# EAGLE board dsp_ice_rev1 (EAGLE 7.6.0), part 1 of 2
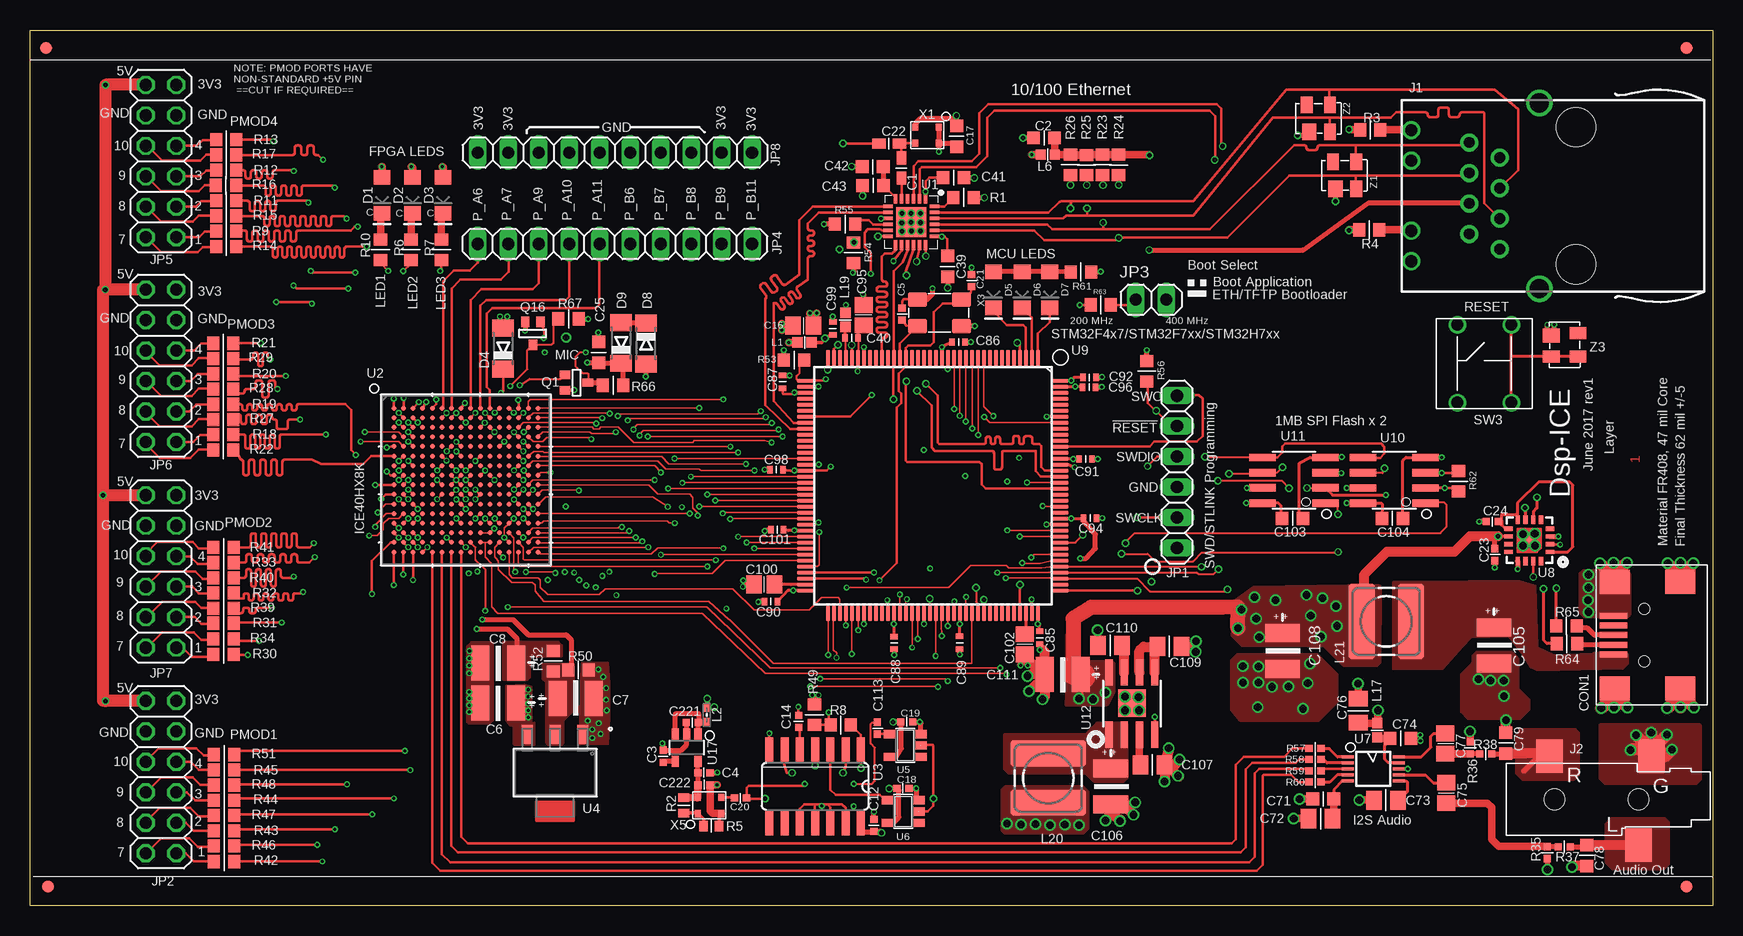
[diagram p9: board, top side]
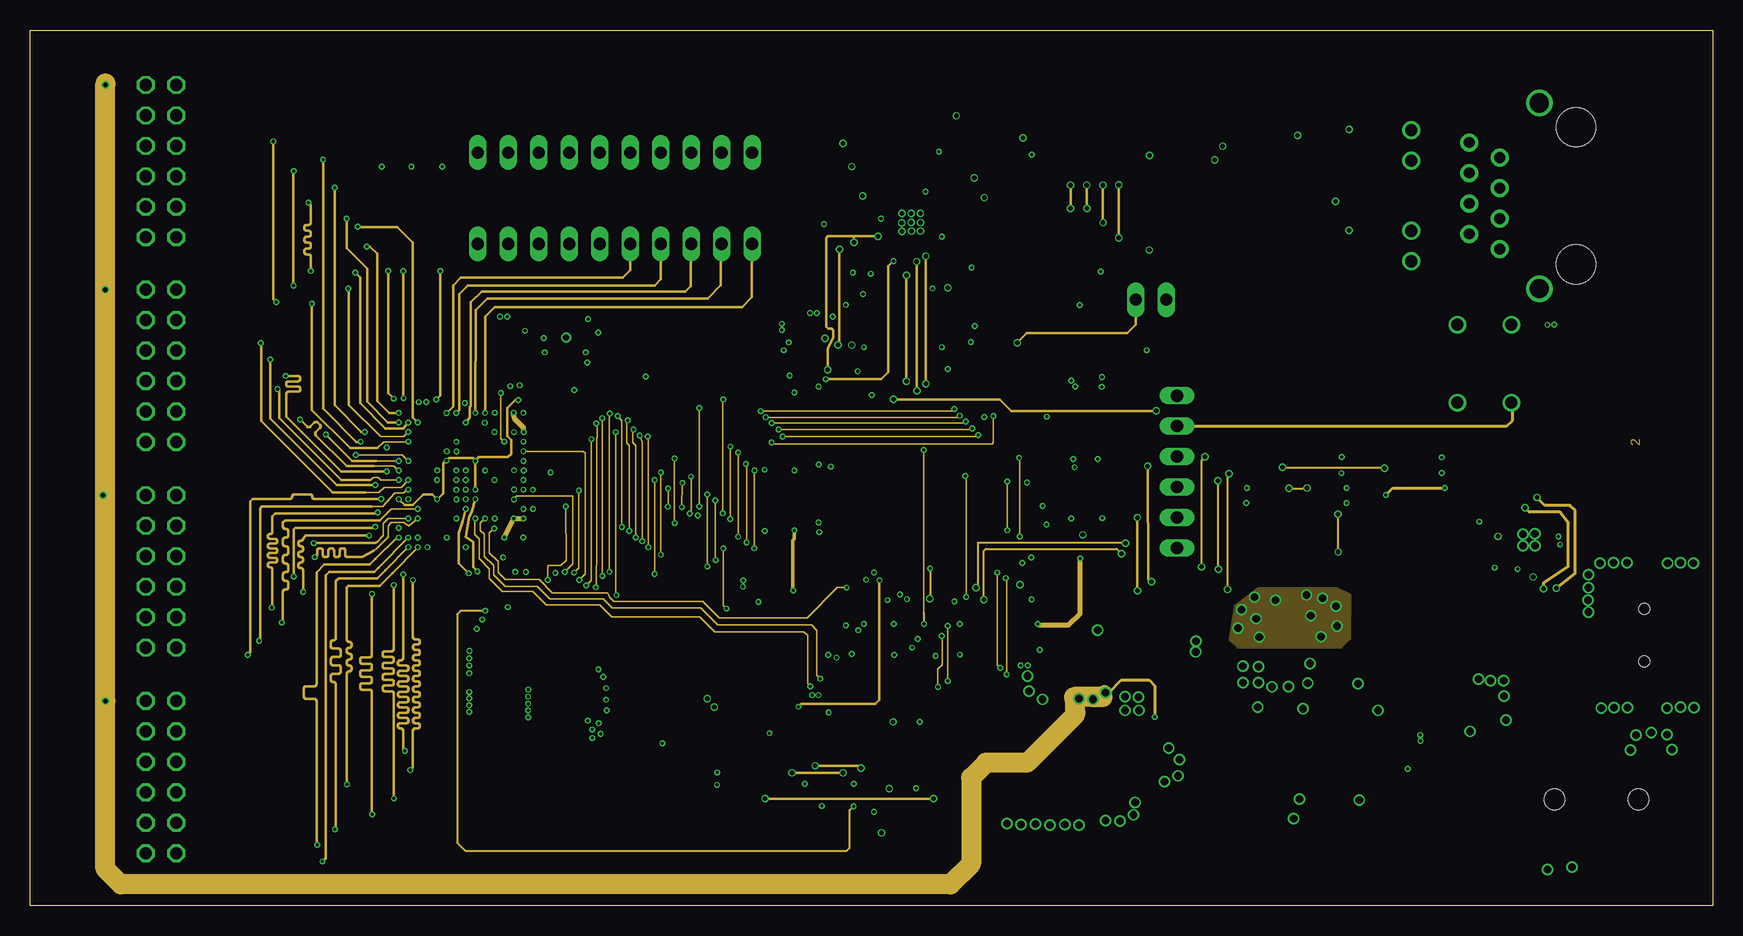
[diagram p10: board, inner layer Route2]
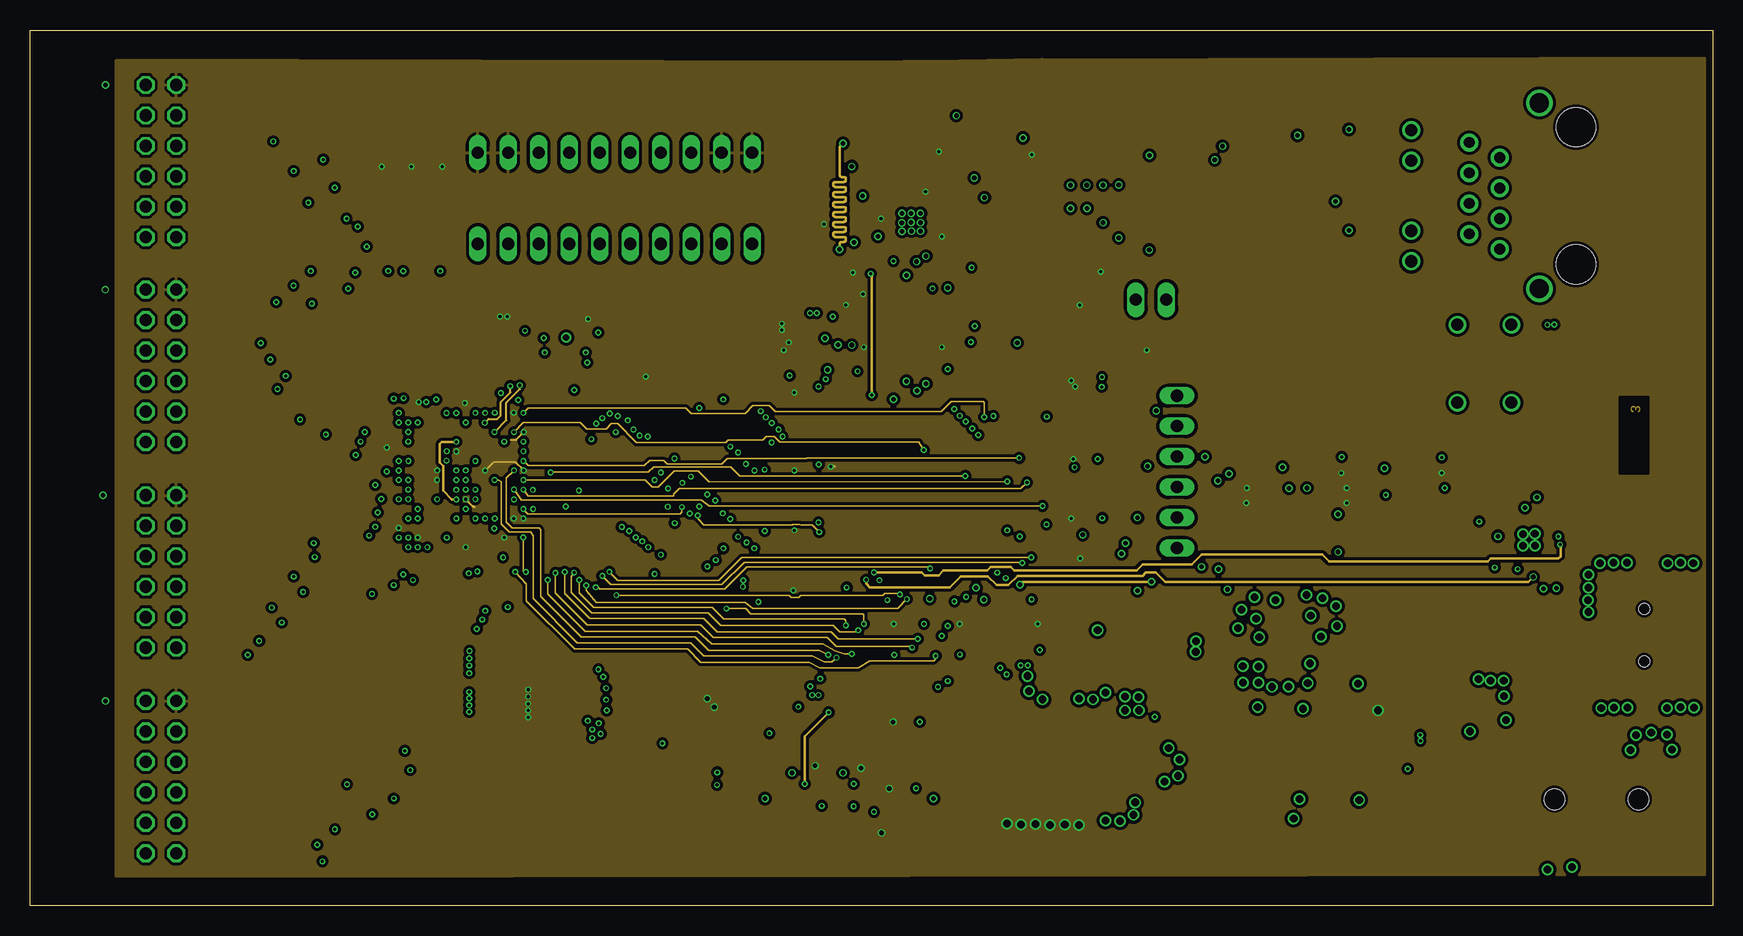
[diagram p11: board, inner layer Route3]
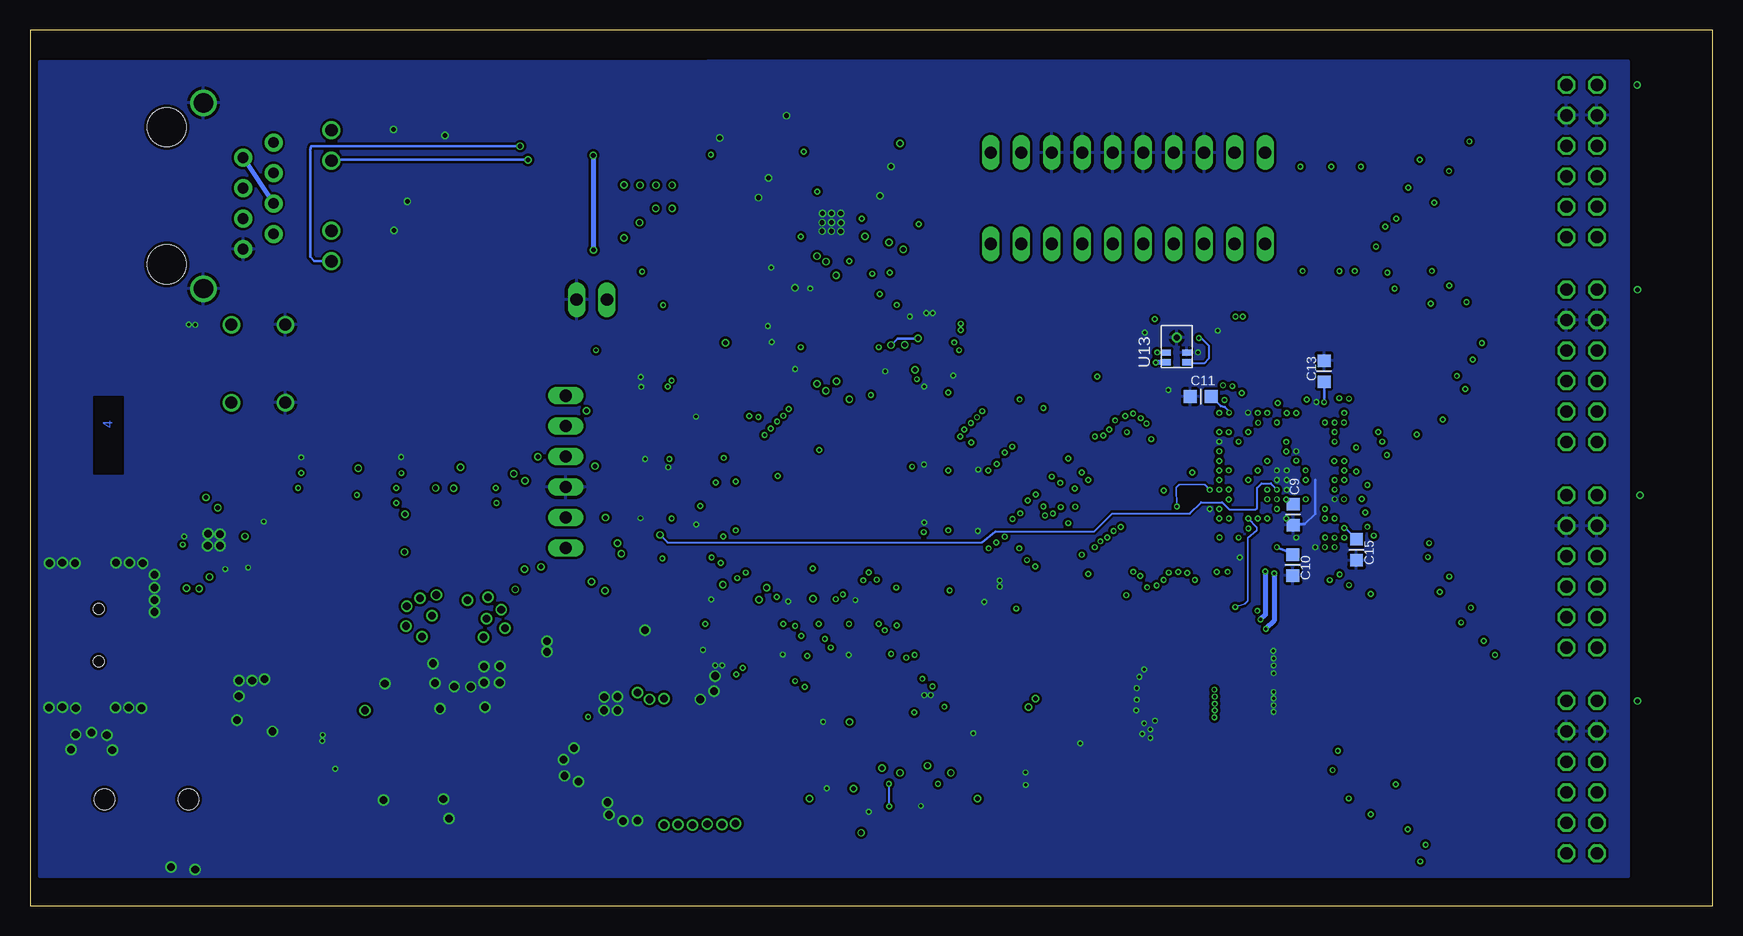
[diagram p12: board, bottom side, seen from below]

Size 140.23 x 73 mm. Coordinates in mm from the lower left corner, seen from the top.
Outline: 0,73 140.23,73 140.23,0 0,0 0,73
Copper layers (1+2+3+16): Top 0.035mm / dielectric 0.2mm / Route2 0.035mm / dielectric 0.15mm / Route3 0.035mm / dielectric 0.2mm / Bottom 0.035mm
Design rules "default *": minimum track width 5mil, minimum drill 10mil, track to track 5mil, track to pad 5mil, pad to pad 5mil, via to via 5mil, smd to smd 1mil, copper to edge 10mil, drill to drill 10mil, minimum pad ring 4.5mil, minimum via ring 4.5mil, stop-mask expansion 0mil, vias tented up to drill 25mil, thermal gap 10mil

## Footprints (pad centres in the part's own frame; a part is rotated, then mirrored left to right if it is on the bottom)
C0603 = smd 1.1 x 0.813: 1 -0.85,0; 2 0.85,0
C0603' = smd 1.05 x 1.08: 1 -0.875,0; 2 0.875,0
C0402 = smd 0.6 x 0.6: 1 -0.5,0; 2 0.501,0
1210K = smd 1.5 x 2.9: A -1.5,0; C 1.5,0
C0805 = smd 1.3 x 1.5: 1 -0.85,0; 2 0.85,0
0402 = smd 0.457 x 0.61: 1 -0.524,0; 2 0.549,0
C0805' = smd 1.3 x 1.6: 1 -1,0; 2 1,0
1734035-2 = smd 2.3 x 0.5: 1 2.9,1.45; 2 2.9,0.65; 3 2.9,-0.15; 4 2.9,-0.95; 5 2.9,-1.75 | smd 2.5 x 2: 6 -2.65,-4.6; 7 -2.65,4.3; 8 2.8,-4.6; 9 2.8,4.3 | hole 0.9: 0.35,2.05; 0.35,-2.35
LED-1206 = smd 1.2 x 1.4: A -1.5,0; C 1.5,0
MINIMELF = smd 1.4 x 1.8: A 1.7,0; C -1.7,0
FIDUCIAL = smd 1.016 x 1.016: 1 0,0
SI-50170 = drill 0.9 pad 1.5: 1 4.445,5.842; 2 3.175,3.302; 3 1.905,5.842; 4 0.635,3.302; 5 -0.635,5.842; 6 -1.905,3.302; 7 -3.175,5.842; 8 -4.445,3.302 | drill 1.016 pad 1.5: A1 -5.461,10.668; A2 2.921,10.668; C1 -2.921,10.668; C2 5.461,10.668 | drill 1.6 pad 2.2: S1 -7.747,0; S2 7.747,0 | hole 3.251: -5.715,-3.048; 5.715,-3.048
SJ-3523 = smd 2.2 x 2.8: G 8.1,3.6; L 7,-3.8; R -0.4,3.6 | hole 1.7: 0,0; 7,0
1X06 = drill 1.016 long: 1 -6.35,0; 2 -3.81,0; 3 -1.27,0; 4 1.27,0; 5 3.81,0; 6 6.35,0
2X06 = drill 1.016 octagon: 1 -6.35,-1.27; 2 -3.81,-1.27; 3 -1.27,-1.27; 4 1.27,-1.27; 5 3.81,-1.27; 6 6.35,-1.27; 7 -6.35,1.27; 8 -3.81,1.27; 9 -1.27,1.27; 10 1.27,1.27; 11 3.81,1.27; 12 6.35,1.27
1X02 = drill 1.016 long: 1 -1.27,0; 2 1.27,0
1X10 = drill 1.016 long: 1 -11.43,0; 2 -8.89,0; 3 -6.35,0; 4 -3.81,0; 5 -1.27,0; 6 1.27,0; 7 3.81,0; 8 6.35,0; 9 8.89,0; 10 11.43,0
0603 = smd 0.864 x 0.864: 1 -0.595,0; 2 0.573,0
0402' = smd 0.7 x 0.6: 1 -0.6,0; 2 0.6,0
POWER-CHOKE_WE-TPC = smd 6.3 x 2.2: 1 0,2.05; 2 0,-2.05
SOT23_2N7002_PACKAGE = smd 0.7 x 0.9: 1 -0.642,-0.916; 2 0.641,-0.916; 3 0,0.992
R0603 = smd 1 x 1.1: 1 -0.85,0; 2 0.85,0
R0402 = smd 0.7 x 0.9: 1 -0.65,0; 2 0.65,0
R0402' = smd 0.6 x 0.6: 1 -0.5,0; 2 0.5,0
TACTILE_6X6MM = drill 1: 1 0,0; 2 4.5,0; 3 4.5,6.5; 4 0,6.5
QFN-24 = smd 0.28 x 0.8: 1 -1.205,-1.836; 2 -0.705,-1.836; 3 -0.205,-1.836; 4 0.295,-1.836; 5 0.795,-1.836; 6 1.295,-1.836; 13 1.3,2.03; 14 0.8,2.03; 15 0.3,2.03; 16 -0.2,2.03; 17 -0.7,2.03; 18 -1.2,2.03 | smd 0.8 x 0.28: 7 1.94,-1.191; 8 1.94,-0.691; 9 1.94,-0.191; 10 1.94,0.309; 11 1.94,0.809; 12 1.94,1.309; 19 -1.929,1.3; 20 -1.929,0.8; 21 -1.929,0.3; 22 -1.929,-0.2; 23 -1.929,-0.7; 24 -1.929,-1.2 | smd 2.5 x 2.5: GP 0,0.1
CABGA256 = smd 0.406 x 0.406: A1 -6,6; A2 -5.2,6; A3 -4.4,6; A4 -3.6,6; A5 -2.8,6; A6 -2,6; A7 -1.2,6; A8 -0.4,6; A9 0.4,6; A10 1.2,6; A11 2,6; A12 2.8,6; A13 3.6,6; A14 4.4,6; A15 5.2,6; A16 6,6; B1 -6,5.2; B2 -5.2,5.2; B3 -4.4,5.2; B4 -3.6,5.2; B5 -2.8,5.2; B6 -2,5.2; B7 -1.2,5.2; B8 -0.4,5.2; B9 0.4,5.2; B10 1.2,5.2; B11 2,5.2; B12 2.8,5.2; B13 3.6,5.2; B14 4.4,5.2; B15 5.2,5.2; B16 6,5.2; C1 -6,4.4; C2 -5.2,4.4; C3 -4.4,4.4; C4 -3.6,4.4; C5 -2.8,4.4; C6 -2,4.4; C7 -1.2,4.4; C8 -0.4,4.4; C9 0.4,4.4; C10 1.2,4.4; C11 2,4.4; C12 2.8,4.4; C13 3.6,4.4; C14 4.4,4.4; C15 5.2,4.4; C16 6,4.4; D1 -6,3.6; D2 -5.2,3.6; D3 -4.4,3.6; D4 -3.6,3.6; D5 -2.8,3.6; D6 -2,3.6; D7 -1.2,3.6; D8 -0.4,3.6; D9 0.4,3.6; D10 1.2,3.6; D11 2,3.6; D12 2.8,3.6; D13 3.6,3.6; D14 4.4,3.6; D15 5.2,3.6; D16 6,3.6; E1 -6,2.8; E2 -5.2,2.8; E3 -4.4,2.8; E4 -3.6,2.8; E5 -2.8,2.8; E6 -2,2.8; E7 -1.2,2.8; E8 -0.4,2.8; E9 0.4,2.8; E10 1.2,2.8; E11 2,2.8; E12 2.8,2.8; E13 3.6,2.8; E14 4.4,2.8; E15 5.2,2.8; E16 6,2.8; F1 -6,2; F2 -5.2,2; F3 -4.4,2; F4 -3.6,2; F5 -2.8,2; F6 -2,2; F7 -1.2,2; F8 -0.4,2; F9 0.4,2; F10 1.2,2; F11 2,2; F12 2.8,2; F13 3.6,2; F14 4.4,2; F15 5.2,2; F16 6,2; G1 -6,1.2; G2 -5.2,1.2; G3 -4.4,1.2; G4 -3.6,1.2; G5 -2.8,1.2; G6 -2,1.2; G7 -1.2,1.2; G8 -0.4,1.2; G9 0.4,1.2; G10 1.2,1.2; G11 2,1.2; G12 2.8,1.2; G13 3.6,1.2; G14 4.4,1.2; G15 5.2,1.2; G16 6,1.2; H1 -6,0.4; H2 -5.2,0.4; H3 -4.4,0.4; H4 -3.6,0.4; H5 -2.8,0.4; H6 -2,0.4; H7 -1.2,0.4; H8 -0.4,0.4; H9 0.4,0.4; H10 1.2,0.4; H11 2,0.4; H12 2.8,0.4; H13 3.6,0.4; H14 4.4,0.4; H15 5.2,0.4; H16 6,0.4; J1 -6,-0.4; J2 -5.2,-0.4; J3 -4.4,-0.4; J4 -3.6,-0.4; J5 -2.8,-0.4; J6 -2,-0.4; J7 -1.2,-0.4; J8 -0.4,-0.4; J9 0.4,-0.4; J10 1.2,-0.4; J11 2,-0.4; J12 2.8,-0.4; J13 3.6,-0.4; J14 4.4,-0.4; J15 5.2,-0.4; J16 6,-0.4; K1 -6,-1.2; K2 -5.2,-1.2; K3 -4.4,-1.2; K4 -3.6,-1.2; K5 -2.8,-1.2; K6 -2,-1.2; K7 -1.2,-1.2; K8 -0.4,-1.2; K9 0.4,-1.2; K10 1.2,-1.2; K11 2,-1.2; K12 2.8,-1.2; K13 3.6,-1.2; K14 4.4,-1.2; K15 5.2,-1.2; K16 6,-1.2; L1 -6,-2; L2 -5.2,-2; L3 -4.4,-2; L4 -3.6,-2; L5 -2.8,-2; L6 -2,-2; L7 -1.2,-2; L8 -0.4,-2; L9 0.4,-2; L10 1.2,-2; L11 2,-2; L12 2.8,-2; L13 3.6,-2; L14 4.4,-2; L15 5.2,-2; L16 6,-2; M1 -6,-2.8; M2 -5.2,-2.8; M3 -4.4,-2.8; M4 -3.6,-2.8; M5 -2.8,-2.8; M6 -2,-2.8; M7 -1.2,-2.8; M8 -0.4,-2.8; M9 0.4,-2.8; M10 1.2,-2.8; M11 2,-2.8; M12 2.8,-2.8; M13 3.6,-2.8; M14 4.4,-2.8; M15 5.2,-2.8; M16 6,-2.8; N1 -6,-3.6; N2 -5.2,-3.6; N3 -4.4,-3.6; N4 -3.6,-3.6; N5 -2.8,-3.6; N6 -2,-3.6; N7 -1.2,-3.6; N8 -0.4,-3.6; N9 0.4,-3.6; N10 1.2,-3.6; N11 2,-3.6; N12 2.8,-3.6; N13 3.6,-3.6; N14 4.4,-3.6; N15 5.2,-3.6; N16 6,-3.6; P1 -6,-4.4; P2 -5.2,-4.4; P3 -4.4,-4.4; P4 -3.6,-4.4; P5 -2.8,-4.4; P6 -2,-4.4; P7 -1.2,-4.4; P8 -0.4,-4.4; P9 0.4,-4.4; P10 1.2,-4.4; P11 2,-4.4; P12 2.8,-4.4; P13 3.6,-4.4; P14 4.4,-4.4; P15 5.2,-4.4; P16 6,-4.4; R1 -6,-5.2; R2 -5.2,-5.2; R3 -4.4,-5.2; R4 -3.6,-5.2; R5 -2.8,-5.2; R6 -2,-5.2; R7 -1.2,-5.2; R8 -0.4,-5.2; R9 0.4,-5.2; R10 1.2,-5.2; R11 2,-5.2; R12 2.8,-5.2; R13 3.6,-5.2; R14 4.4,-5.2; R15 5.2,-5.2; R16 6,-5.2; T1 -6,-6; T2 -5.2,-6; T3 -4.4,-6; T4 -3.6,-6; T5 -2.8,-6; T6 -2,-6; T7 -1.2,-6; T8 -0.4,-6; T9 0.4,-6; T10 1.2,-6; T11 2,-6; T12 2.8,-6; T13 3.6,-6; T14 4.4,-6; T15 5.2,-6; T16 6,-6
SO14 = smd 0.66 x 2.032: 1 -3.81,-3.073; 2 -2.54,-3.073; 3 -1.27,-3.073; 4 0,-3.073; 5 1.27,-3.073; 6 2.54,-3.073; 7 3.81,-3.073; 8 3.81,3.073; 9 2.54,3.073; 10 1.27,3.073; 11 0,3.073; 12 -1.27,3.073; 13 -2.54,3.073; 14 -3.81,3.073
SOT-223 = smd 0.914 x 1.6: 1 -2.3,-3.2; 2 0,-3.2; 3 2.3,-3.2
SOT23-5 = smd 0.69 x 0.99: 1 -0.95,-1.29; 2 0,-1.29; 3 0.95,-1.29; 4 0.95,1.3; 5 -0.95,1.3
MSOP10 = smd 0.25 x 1: 1 -1,-2.113; 2 -0.5,-2.113; 3 0,-2.113; 4 0.5,-2.113; 5 1,-2.113; 6 1,2.113; 7 0.5,2.113; 8 0,2.113; 9 -0.5,2.113; 10 -1,2.113
QFN16 = smd 0.7 x 0.35: 1 -1.725,0.975; 2 -1.725,0.325; 3 -1.725,-0.325; 4 -1.725,-0.975; 9 1.725,-0.975; 10 1.725,-0.325; 11 1.725,0.325; 12 1.725,0.975 | smd 0.35 x 0.7: 5 -0.975,-1.725; 6 -0.325,-1.725; 7 0.325,-1.725; 8 0.975,-1.725; 13 0.975,1.725; 14 0.325,1.725; 15 -0.325,1.725; 16 -0.975,1.725 | smd 1 x 1: TAB 0,0
STM32F407_144 = smd 1.35 x 0.32: 1 -10.625,8.75; 2 -10.625,8.25; 3 -10.625,7.75; 4 -10.625,7.25; 5 -10.625,6.75; 6 -10.625,6.25; 7 -10.625,5.75; 8 -10.625,5.25; 9 -10.625,4.75; 10 -10.625,4.25; 11 -10.625,3.75; 12 -10.625,3.25; 13 -10.625,2.75; 14 -10.625,2.25; 15 -10.625,1.75; 16 -10.625,1.25; 17 -10.625,0.75; 18 -10.625,0.25; 19 -10.625,-0.25; 20 -10.625,-0.75; 21 -10.625,-1.25; 22 -10.625,-1.75; 23 -10.625,-2.25; 24 -10.625,-2.75; 25 -10.625,-3.25; 26 -10.625,-3.75; 27 -10.625,-4.25; 28 -10.625,-4.75; 29 -10.625,-5.25; 30 -10.625,-5.75; 31 -10.625,-6.25; 32 -10.625,-6.75; 33 -10.625,-7.25; 34 -10.625,-7.75; 35 -10.625,-8.25; 36 -10.625,-8.75; 73 10.625,-8.75; 74 10.625,-8.25; 75 10.625,-7.75; 76 10.625,-7.25; 77 10.625,-6.75; 78 10.625,-6.25; 79 10.625,-5.75; 80 10.625,-5.25; 81 10.625,-4.75; 82 10.625,-4.25; 83 10.625,-3.75; 84 10.625,-3.25; 85 10.625,-2.75; 86 10.625,-2.25; 87 10.625,-1.75; 88 10.625,-1.25; 89 10.625,-0.75; 90 10.625,-0.25; 91 10.625,0.25; 92 10.625,0.75; 93 10.625,1.25; 94 10.625,1.75; 95 10.625,2.25; 96 10.625,2.75; 97 10.625,3.25; 98 10.625,3.75; 99 10.625,4.25; 100 10.625,4.75; 101 10.625,5.25; 102 10.625,5.75; 103 10.625,6.25; 104 10.625,6.75; 105 10.625,7.25; 106 10.625,7.75; 107 10.625,8.25; 108 10.625,8.75 | smd 0.32 x 1.35: 37 -8.75,-10.625; 38 -8.25,-10.625; 39 -7.75,-10.625; 40 -7.25,-10.625; 41 -6.75,-10.625; 42 -6.25,-10.625; 43 -5.75,-10.625; 44 -5.25,-10.625; 45 -4.75,-10.625; 46 -4.25,-10.625; 47 -3.75,-10.625; 48 -3.25,-10.625; 49 -2.75,-10.625; 50 -2.25,-10.625; 51 -1.75,-10.625; 52 -1.25,-10.625; 53 -0.75,-10.625; 54 -0.25,-10.625; 55 0.25,-10.625; 56 0.75,-10.625; 57 1.25,-10.625; 58 1.75,-10.625; 59 2.25,-10.625; 60 2.75,-10.625; 61 3.25,-10.625; 62 3.75,-10.625; 63 4.25,-10.625; 64 4.75,-10.625; 65 5.25,-10.625; 66 5.75,-10.625; 67 6.25,-10.625; 68 6.75,-10.625; 69 7.25,-10.625; 70 7.75,-10.625; 71 8.25,-10.625; 72 8.75,-10.625; 109 8.75,10.625; 110 8.25,10.625; 111 7.75,10.625; 112 7.25,10.625; 113 6.75,10.625; 114 6.25,10.625; 115 5.75,10.625; 116 5.25,10.625; 117 4.75,10.625; 118 4.25,10.625; 119 3.75,10.625; 120 3.25,10.625; 121 2.75,10.625; 122 2.25,10.625; 123 1.75,10.625; 124 1.25,10.625; 125 0.75,10.625; 126 0.25,10.625; 127 -0.25,10.625; 128 -0.75,10.625; 129 -1.25,10.625; 130 -1.75,10.625; 131 -2.25,10.625; 132 -2.75,10.625; 133 -3.25,10.625; 134 -3.75,10.625; 135 -4.25,10.625; 136 -4.75,10.625; 137 -5.25,10.625; 138 -5.75,10.625; 139 -6.25,10.625; 140 -6.75,10.625; 141 -7.25,10.625; 142 -7.75,10.625; 143 -8.25,10.625; 144 -8.75,10.625
SO8 = smd 0.61 x 2.21: 1 -1.905,-2.616; 2 -0.635,-2.616; 3 0.635,-2.616; 4 1.905,-2.616; 5 1.905,2.616; 6 0.635,2.616; 7 -0.635,2.616; 8 -1.905,2.616
SO8' = smd 0.6 x 2.2: 1 -1.905,-2.62; 2 -0.635,-2.62; 3 0.635,-2.62; 4 1.905,-2.62; 5 1.905,2.58; 6 0.635,2.58; 7 -0.635,2.58; 8 -1.905,2.58 | smd 2.29 x 2.29: GPAD 0,0
CS7250B-CAZR = smd 0.522 x 0.725: 1 2.074,0.838; 2 1.252,0.838; 4 1.252,-0.838; 5 2.074,-0.838 | drill 0.525 pad 0.825: 3 0,0
SOT23-6 = smd 0.6 x 0.9: 1 -0.72,-1.15; 2 0.23,-1.15; 3 1.18,-1.15; 4 1.18,1.15; 5 -0.71,1.15
CRYSTAL_2.5_2MM = smd 0.5 x 0.6: GND 1,-0.6; OUTPUT 1,0.75; VCC -0.95,-0.6; VDD -0.95,0.75
ECS-250-20-30B-DU_CRYSTAL = smd 1.6 x 1.25: 1 -1.9,-1.1; 3 1.8,1.1; GND@1 -1.9,1.1; GND@2 1.8,-1.1
SR2.8.TCT_1PRIMARY = smd 1.397 x 1.194: 1 -1.168,0.813 | smd 1.397 x 0.991: 2 -1.168,-0.914; 3 1.067,-0.914; 4 1.067,1.016

## Placement (x,y rotation side)
C1  100pF  [C0603]  72.62,61.48 90 top
C2  0.1uF  [C0603']  84.51,64 180 top
C3  .01uF  [C0402]  52.77,12.45 90 top
C4  1.0uF  [C0402]  56.16,11.06 0 top
C5  [C0402]  72.67,49.32 270 top
C6  22uF  [1210K]  39,16.91 180 top
C7  22uF  [1210K]  45.48,17.26 0 top
C8  22uF  [1210K]  39.01,20.23 180 top
C9  0.1uF  [C0603']  34.98,32.59 270 bottom
C10  1uF  [C0603']  35,28.39 270 bottom
C11  1uF  [C0603']  42.67,42.43 180 bottom
C12  47nF  [C0402]  70.33,6.7 90 top
C13  1uF  [C0603']  32.38,44.54 90 bottom
C14  47nF  [C0402]  64.06,15.36 90 top
C15  1uF  [C0603']  29.69,29.66 270 bottom
C16  2.2uF  [C0805]  64.44,48.35 0 top
C17  0.1uF  [C0603']  77.22,64.13 90 top
C18  47nF  [C0402]  72.75,9.77 0 top
C19  47nF  [C0402]  73.05,15.31 0 top
C20  47nF  [C0402]  59.21,8.98 180 top
C21  [C0402]  78.46,52.11 270 top
C22  100pF  [C0603]  71.6,63.52 0 top
C23  1.0uF  [C0402]  122.07,29.25 270 top
C24  1.0uF  [C0402]  121.84,32.02 180 top
C25  1uF  [C0603']  47.4,46.12 90 top
C39  0.1uF  [C0603']  76.47,53.28 270 top
C40  0.1uF  [0402]  68.45,47.34 0 top
C41  0.1uF  [C0603']  76.96,60.68 0 top
C42  1uF  [C0603']  70.23,61.6 180 top
C43  470pF  [C0603']  70.26,60.04 180 top
C71  0.1uF  [C0603']  107.77,8.88 180 top
C72  10uF  [C0805']  107.54,7.26 180 top
C73  10uF  [C0805']  113,8.78 0 top
C74  0.1uF  [C0603']  114.22,13.94 0 top
C75  2.2uF  [C0805]  118.01,9.39 90 top
C76  2.2uF  [C0805']  110.69,16.25 90 top
C77  2.2uF  [C0805]  117.96,13.5 90 top
C78  8200pF  [C0603']  129.72,4.18 270 top
C79  8200pF  [C0603']  122.99,13.55 90 top
C85  0.1uF  [0402]  84.15,22.34 270 top
C86  0.1uF  [0402]  77.37,46.98 0 top
C87  0.1uF  [0402]  62.71,43.65 90 top
C88  0.1uF  [0402]  72.01,21.91 270 top
C89  0.1uF  [0402]  77.47,21.94 270 top
C90  0.1uF  [0402]  61.77,25.34 180 top
C91  0.1uF  [0402]  87.96,37.23 0 top
C92  0.1uF  [0402]  88.27,44.03 0 top
C94  0.1uF  [0402]  88.32,32.3 0 top
C95  2.2uF  [C0805]  69.47,49.22 270 top
C96  0.1uF  [0402]  88.24,43.22 0 top
C98  0.1uF  [0402]  62.23,36.34 180 top
C99  0.1uF  [0402]  66.9,48.1 90 top
C100  2.2uF  [C0805]  61.19,26.76 180 top
C101  0.1uF  [0402]  62.28,31.33 180 top
C102  2.2uF  [C0805]  82.91,21.78 270 top
C103  0.1uF  [C0603']  105.21,32.28 0 top
C104  0.1uF  [C0603']  113.54,32.28 0 top
C105  470uF_tant  [1210K]  122,21.71 270 top
C106  470uF_tant  [1210K]  90.07,9.92 270 top
C107  2.2uF  [C0805']  93.55,11.73 0 top
C108  470uF_tant  [1210K]  104.37,21.23 270 top
C109  2.2uF  [C0805']  94.97,21.61 0 top
C110  2.2uF  [C0805']  89.99,21.68 180 top
C111  22uF  [1210K]  86.06,19.27 180 top
C113  47nF  [C0402]  70.61,14.79 270 top
C221  1.0uF  [C0402]  55.18,15.28 180 top
C222  18pF  [C0402]  56.17,10.05 0 top
CON1  1734035-2  [1734035-2]  134.87,22.39 180 top
D1  [LED-1206]  29.34,59.22 270 top
D2  [LED-1206]  31.88,59.22 270 top
D3  [LED-1206]  34.42,59.22 270 top
D4  [MINIMELF]  39.42,46.43 90 top
D5  [LED-1206]  80.29,51.35 270 top
D6  [LED-1206]  82.68,51.35 270 top
D7  [LED-1206]  84.99,51.35 270 top
D8  [MINIMELF]  51.33,46.85 270 top
D9  [MINIMELF]  49.25,46.9 90 top
FID1  FIDUCIALSMD  [FIDUCIAL]  138.02,1.6 0 top
FID2  FIDUCIALSMD  [FIDUCIAL]  1.35,71.5 0 top
FID3  FIDUCIALSMD  [FIDUCIAL]  138.05,71.5 0 top
FID4  FIDUCIALSMD  [FIDUCIAL]  1.5,1.6 0 top
J1  SI-50170  [SI-50170]  125.78,59.17 90 top
J2  SJ-3523  [SJ-3523]  127.03,8.86 0 top
JP1  [1X06]  95.58,36.16 90 top
JP2  [2X06]  10.92,10.71 90 top
JP3  [1X02]  93.42,50.51 0 top
JP4  [1X10]  48.74,55.16 180 top
JP5  [2X06]  10.92,62.07 90 top
JP6  [2X06]  10.92,45 90 top
JP7  [2X06]  10.92,27.85 90 top
JP8  [1X10]  48.74,62.78 0 top
L1  [0603]  64.57,46.96 0 top
L2  [0402']  56.39,15.89 270 top
L6  [0603]  84.82,62.6 0 top
L17  [0603]  112.27,14.62 90 top
L19  [0603]  67.95,48.83 270 top
L20  22uH_744053220  [POWER-CHOKE_WE-TPC]  84.86,10.63 0 top
L21  22uH_744053220  [POWER-CHOKE_WE-TPC]  113.03,23.69 90 top
Q1  2N7002  [SOT23_2N7002_PACKAGE]  45.49,43.6 270 top
Q16  2N7002  [SOT23_2N7002_PACKAGE]  41.91,47.74 180 top
R1  12.1k  [R0603]  77.8,59.03 0 top
R2  470 (Tc=50ppm)  [R0402]  54.47,8.36 270 top
R3  270  [R0603]  111.68,64.67 180 top
R4  270  [R0603]  111.61,56.34 180 top
R5  470 (Tc=50ppm)  [R0402]  56.78,6.62 0 top
R6  270  [R0603]  31.75,54.68 270 top
R7  270  [R0603]  34.29,54.68 270 top
R8  4.87K  [R0603]  67.56,15.05 180 top
R9  10  [R0603]  16.36,56.23 180 top
R10  270  [R0603]  29.21,54.68 270 top
R11  10  [R0603]  16.36,58.77 180 top
R12  10  [R0603]  16.36,61.31 180 top
R13  10  [R0603]  16.36,63.85 180 top
R14  10  [R0603]  16.36,54.93 0 top
R15  10  [R0603]  16.36,57.5 0 top
R16  10  [R0603]  16.33,60.04 0 top
R17  10  [R0603]  16.36,62.58 0 top
R18  10  [R0603]  16.1,39.26 180 top
R19  10  [R0603]  16.1,41.8 180 top
R20  10  [R0603]  16.1,44.34 180 top
R21  10  [R0603]  16.1,46.88 180 top
R22  10  [R0603]  16.1,37.99 0 top
R23  49.9  [R0603]  89.37,61.75 270 top
R24  49.9  [R0603]  90.7,61.74 270 top
R25  49.9  [R0603]  88.05,61.73 270 top
R26  49.9  [R0603]  86.72,61.75 270 top
R27  10  [R0603]  16.1,40.53 0 top
R28  10  [R0603]  16.1,43.07 0 top
R29  10  [R0603]  16.1,45.61 0 top
R30  10  [R0603]  16.13,20.95 180 top
R31  10  [R0603]  16.13,23.54 180 top
R32  10  [R0603]  16.13,26.05 180 top
R33  10  [R0603]  16.13,28.59 180 top
R34  10  [R0603]  16.13,22.24 0 top
R35  10k  [R0402']  126.44,4.41 90 top
R36  10k  [R0402']  120.01,13.15 270 top
R37  470  [R0402']  127.86,4.89 180 top
R38  470  [R0402']  121.31,12.64 180 top
R39  10  [R0603]  16.13,24.78 0 top
R40  10  [R0603]  16.13,27.32 0 top
R41  10  [R0603]  16.13,29.86 0 top
R42  10  [R0603]  16.18,3.67 180 top
R43  10  [R0603]  16.18,6.24 180 top
R44  10  [R0603]  16.18,8.78 180 top
R45  10  [R0603]  16.18,11.32 180 top
R46  10  [R0603]  16.18,4.97 0 top
R47  10  [R0603]  16.18,7.51 0 top
R48  10  [R0603]  16.18,10.05 0 top
R49  4.87K  [R0603]  65.37,15.9 90 top
R50  120  [R0603]  45.71,19.65 180 top
R51  10  [R0603]  16.18,12.59 0 top
R52  10  [R0603]  43.6,20.39 90 top
R53  12.1k  [R0603]  63.68,45.48 0 top
R54  12.1k  [R0603]  68.63,54.42 90 top
R55  12.1k  [R0603]  67.92,56.81 0 top
R56  12.1k  [R0603]  93.07,44.54 270 top
R57  470  [R0402']  107.09,13.1 180 top
R58  470  [R0402']  107.09,12.18 180 top
R59  470  [R0402']  107.09,11.22 180 top
R60  470  [R0402']  107.09,10.3 180 top
R61  270  [R0603]  87.58,52.82 180 top
R62  12.1k  [R0603]  119.05,35.37 270 top
R63  12.1k  [R0603]  89.23,50.08 0 top
R64  27  [R0603]  128.07,21.83 0 top
R65  27  [R0603]  128.04,23.31 180 top
R66  1k  [R0603]  48.59,43.37 0 top
R67  1k  [R0603]  44.88,48.91 0 top
SW3  HOKURIKU_KSM06_6X6MM_SWITCH1  [TACTILE_6X6MM]  118.95,41.93 0 top
U1  LAN8742  [QFN-24]  73.43,57.09 180 top
U2  ICE40HX8K-CT256  [CABGA256]  36.32,35.47 0 top
U3  SN74AC74DR  [SO14]  65.43,9.93 180 top
U4  LD1117S12TR  [SOT-223]  43.75,11.06 180 top
U5  74LVC1G04DBV  [SOT23-5]  72.95,13.35 90 top
U6  74LVC1G04DBV  [SOT23-5]  72.77,7.84 90 top
U7  CS4344  [MSOP10]  111.94,11.4 270 top
U8  FT230XQ  [QFN16]  124.94,30.45 180 top
U9  STM32F765ZGT6  [STM32F407_144]  75.23,35.02 270 top
U10  S25FL116K0XMFI041  [SO8]  113.68,35.45 90 top
U11  S25FL116K0XMFI041  [SO8]  105.34,35.46 90 top
U12  ADP7156ARDZ-3.3-R7  [SO8']  91.82,16.86 0 top
U13  CS7250B  [CS7250B-CAZR]  44.68,47.36 270 bottom
U17  TPS799X  [SOT23-6]  54.95,13.17 180 top
X1  ASDM1-50.000MHZ-LC-T  [CRYSTAL_2.5_2MM]  74.78,64.3 180 top
X3  DNP  [ECS-250-20-30B-DU_CRYSTAL]  75.74,49.42 180 top
X5  ASVTX-12-A-40.000MHZ-H10-T  [CRYSTAL_2.5_2MM]  56.59,8.27 0 top
Z1  SR3.3.TCT  [SR2.8.TCT_1PRIMARY]  109.6,60.93 90 top
Z2  SR3.3.TCT  [SR2.8.TCT_1PRIMARY]  107.42,65.67 90 top
Z3  SR3.3.TCT  [SR2.8.TCT_1PRIMARY]  127.94,46.7 0 top

## Tracks (layer width: path | path; a pad name or v marks a point on that pad's centre or on a via)
3V
  Top 0.406: C222.1 55.66,10.06 C4.1 U17.5
  Top 0.61: C222.1 55.64,10.02 X5.VDD 55.61,8.99 R2.1
3V3  (via drill 0.25, 0.25 pad 0.25, 0.25 pad 0.41, 0.38, 0.64)
  Top 0.127: U2.N13 39.52,31.46 v39.52,30.67
  Top 0.203: v33.93,36.29 v33.94,36.29 U2.G6 | v35.53,37.86 U2.F8 | U2.H10 | U2.H10 v37.92,36.27 | U2.J6 | U2.J6 v33.92,35.47 | v29.73,38.18 30.09,38.28 U2.E1 | U2.A3 v32.4,41.96 | U2.A8 v36.25,41.89 | U2.A13 v40.31,41.09 | U2.C15 | U2.C15 v41.13,39.49 | v41.13,36.26 41.12,36.27 U2.H15 | U2.N15 41.16,32.29 v41.12,32.27 41.08,32.24 | v40.32,32.27 | v40.32,32.27 U2.N13 | v39.52,30.67 U2.R13 | U2.R8 | U2.R8 v36.32,29.87 | U2.P3 v32.31,30.69 | U2.N1 v30.72,31.47 | 64.47,36.27 66.4,36.27 v66.73,36.59 | C41.1 76.07,60.7 74.95,60.7 74.64,60.38 U1.1 74.64,59.52 v74.62,59.53 | U1.19 76.02,55.79 | C39.1 76.45,54.17 76.45,55.57 76.23,55.79 76.02,55.79 | 76.02,55.79 v76,55.77 | U1.9 70.93,57.28 v70.92,57.27 | R8.1 69.24,14.23 U3.1 v69.24,11.47 | U3.4 v65.43,11.65 | v63.7,42.77 63.6,42.66 62.76,42.66 62.71,42.71 C87.1 | 69.27,6.89 U3.14 | U2.K8 | U2.K8 v36.32,33.87 | v117.64,36.07 118.9,36.07 R62.1 | R63.1 87.5,50.08 v87.48,50.05
  Top 0.254: U9.143 86.77,43.27 v87.1,43.27 87.61,43.32 C96.1 | U9.144 86.77,43.77 v86.77,43.78 87.02,44.03 C92.1 | U9.121 v86.77,32.27 87.77,32.27 C94.1 | U9.131 86.77,37.27 v86.94,37.23 | U9.108 v83.97,23.49 84.12,23.33 C85.1 | U9.95 77.47,24.39 v77.47,23.49 C89.1 | U9.84 v71.98,23.49 72.01,23.46 C88.1 | U9.72 v63.6,26.27 | v63.6,26.27 63.6,26.25 | U9.62 63.7,31.27 | 63.7,31.27 v63.7,31.28 | U9.52 64.47,36.27 63.83,36.27 63.83,36.21 63.7,36.21 v63.7,36.26 63.7,36.24 C98.1 | U9.39 v63.7,42.77 v63.7,42.76 | U9.30 69.49,45.64 v69.49,46.55 | U9.17 76,45.64 v76,46.55 76.05,46.6 C86.1 | 63.7,31.27 63.19,31.27 C101.1 | v63.6,26.27 63.16,26.27 C90.1 | C91.1 v86.94,37.23 | 86.79,37.23 v86.94,37.23 | L19.1 v68,50.08 | 69.55,50 69.62,50.08 | 69.62,50.08 69.48,50.08 C95.1 | 69.67,50.13 69.62,50.08 | C103.1 104.25,32.21 104.25,33.33 104.03,33.55 U11.8 v101.36,33.56 | C104.1 112.69,33.48 112.61,33.56 111.07,33.56 U10.8 v109.72,33.56 | U11.3 108,36.05 v109.28,36.05 | U10.7 111.05,34.8 v109.72,34.8 | U11.7 102.74,34.8 v101.41,34.8 | U10.3 116.31,36.07 v117.64,36.07
  Top 0.406: v39.17,49.11 39.17,48.13 D4.A 39.78,48.13 39.78,49.14 | X1.VDD 75.73,62.87 v75.74,62.86 | X1.VDD 76.91,63.55 C17.1 | X1.VCC X1.VDD | 69.48,50.08 69.48,50.9 v69.42,50.97 | U5.5 72.2,12.4 72.62,13.07 72.62,15.04 C19.1 v71.93,15.31 | U6.5 71.95,6.89 72.42,7.36 72.42,9.6 C18.1 71.63,9.77 v71.6,9.74 | U3.14 69.24,6.24 69.34,6.14 70.27,6.14 C12.1 70.83,6.2 v70.97,6.06 | L2.1 56.48,16.49 | 56.48,16.49 56.96,16.49 v57.02,16.55 | 56.48,16.49 56.48,17.22 56.44,17.26 | R56.1 v93.07,46.3 | R53.1 62.83,46.28 v62.81,46.3 | R55.1 v66.17,56.81 | R54.1 68.63,52.82 v68.58,52.77 | R61.1 v89.23,52.85 | v87.53,28.95 88.01,28.95 88.77,29.76 88.77,30.98 87.83,32.07 87.81,32.27 C94.1 | D8.A 51.31,45.15 v51.31,44.11 | R67.2 46.48,48.91 v46.51,48.89
  Top 0.61: C76.1 110.75,15.19 L17.2 112.32,15.25 v112.32,16.27 | D3.A 34.42,61.55 v34.37,61.6 | D2.A 31.88,61.52 v31.79,61.61 | D1.A 29.34,61.59 v29.32,61.6 | v63.22,46.95 L1.1 | v62.66,48.51 62.81,48.35 C16.1 63.07,48.35 62.69,47.97 v62.66,47.97 | L6.1 v83.49,62.6
  Route2 0.152: 40.28,41.09 v40.31,41.09
  Route2 0.203: v65.43,11.65 69.06,11.65 v69.24,11.47
  Route2 0.305: v63.7,31.28 63.7,30.55 63.58,30.42 63.58,26.29 v63.6,26.27
  Route2 0.406: v41.13,39.49 41.13,39.83 40.41,40.55 40.28,41.09 | v39.52,30.67 40.31,32.33 | v40.32,32.27 v41.12,32.27 | 84.07,23.38 86.54,23.38 87.5,24.35 87.5,28.92 v87.53,28.95
  Route3 0.127: v41.13,36.26 41.13,36.3 40.44,37 38.68,37 38.58,36.9 38.54,36.9 v37.92,36.27 | v41.13,39.49 41.13,39.48 40.92,39.26 | 40.03,38.83 40.49,38.83 40.92,39.26 | 40.95,39.26 40.92,39.26
  Route3 0.203: v66.73,36.59 67,36.59 | v36.32,33.87 36.32,33.85 36.88,33.29 36.96,33.29 37.01,33.24
  Bottom 0.203: v30.72,31.47 30.63,31.47 C15.1 | v40.31,41.09 40.31,41.19 40.69,41.57 41.02,41.65 C11.1 | v32.4,41.96 32.4,43.65 C13.1 | v36.32,29.87 35.69,29.62 C10.1
  other vias: 87.4,6.72 86.23,6.75 85.01,6.72 83.79,6.8 82.58,6.75 81.43,6.82 39.78,49.11 41.53,18 41.5,17.41 41.5,16.83 41.5,16.27 41.53,15.69 56.44,17.24
  pour Top (no thermals): 88.14,9.52 88.14,6.39 87.76,6.01 81.23,6.01 81.03,6.21 81.03,9.67 81.28,9.92 87.73,9.92
  pour Route3 (isolate 0.254): 7.19,70.5 68.12,70.37 77.42,70.42 84.3,70.58 84.35,70.53 84.4,70.53 139.52,70.68 139.52,2.56 7.19,2.38
  pour Top (no thermals): 40.31,13.48 40.31,15.03 40.46,15.18 42.04,15.23 42.04,13.38 40.41,13.38
  pour Top (no thermals): 40.28,15.03 40.01,15.03 39.7,15.46 39.7,18.33 41.17,18.38 41.78,18.23 41.78,15.33 41,15
3V_ANALOG  (via drill 0.38)
  Top 0.203: U9.32 v68.48,46.72 v68.48,46.73 | C99.1 66.6,47.56 v66.24,47.28
  Top 0.305: L1.2 65.99,46.95 v66.24,47.28
  Bottom 0.203: v66.24,47.28 67.92,47.28 v68.48,46.73
20MHZ_REF  (via drill 0.25)
  Top 0.203: v70.79,27.12 72.24,28.57 72.24,41.52 72.59,41.88 72.59,42.69 72.39,42.89 72.39,44.34 72.98,44.93 U9.23 72.98,46.48 73.2,46.7 75.03,46.7 75.31,46.98 75.31,49.47 76.05,50.21 77.33,50.21 X3.1 77.78,50.52 78.38,51.12 78.46,51.56 C21.2 | v64.03,16.58 64.03,15.88 C14.2
  Route2 0.203: v70.79,27.12 70.79,17.16 70.43,16.8 64.26,16.8 v64.03,16.58
!ETH_INT  (via drill 0.25)
  Top 0.152: U9.37 63.97,43.77 63.88,43.86 63.88,44.16 64.14,44.41 64.14,45.09 R53.2
  Top 0.203: U1.14 72.63,54.59 72.52,54.47 v71.96,53.74 | v66.32,43.88 66.2,43.77 U9.37
  Route2 0.203: v71.96,53.74 71.53,53.3 71.53,44.49 70.92,43.88 v66.32,43.88
!RESET  (via drill 0.38)
  Top 0.203: JP1.5 95.12,39.97 v93.85,41.24 93.8,41.24 93.14,41.9 93.14,43.62 R56.2 | v71.96,42.2 71.96,45.62 U9.25 71.98,52.9 72.72,53.63 73.13,54.63 U1.15
  Top 0.254: SW3.2 123.45,45.79 | 123.45,45.79 SW3.3 | Z3.3 Z3.2 123.45,45.79
  Route2 0.203: v93.85,41.24 81.79,41.24 80.82,42.2 v71.96,42.2
  Route2 0.254: JP1.5 123.06,39.97 123.55,40.45 123.55,41.93 | 123.55,41.93 123.55,41.96 123.45,42.05 | SW3.2 123.55,41.93
!RUN_BOOTL  (via drill 0.38)
  Top 0.203: R63.2 91.72,50.08 JP3.1 | U9.4 82.48,46.72 v82.27,46.93
  Route2 0.203: v82.27,46.93 83.06,47.72 91.44,47.72 92.15,48.43 JP3.1
+5V  (via drill 0.25, 0.38, 0.64)
  Top 0.203: 87.69,19.14 87.69,17.55 v87.4,17.26
  Top 0.254: v93.73,15.74 U12.4 | U8.10 v122.33,30.77 | 111.07,24.65 110.92,24.5 110.92,23.75 L21.1
  Top 0.406: C23.1 122.07,30.52 v122.33,30.77
  Top 0.813: v122.33,30.77 119.99,30.77 118.69,29.48 113.08,29.48 111.15,27.55 111.15,23.66 111.12,23.64 111.12,23.79 111.1,23.82
  Top 1.016: JP5.12 v6.3,68.42 6.27,68.42 v6.27,51.35 | JP6.12 v6.27,51.35 | JP7.12 v6.07,34.2 | JP2.12 v6.29,17.06 | v6.27,51.35 6.07,51.35 6.07,17.09
  Top 1.27: v100.66,23.13 100.69,24.88 99.36,24.86 88.43,24.86 86.92,23.92 86.92,19.55
  Top 2.184: 86.92,19.55 87.69,19.14
  Route2 0.254: v89.61,17.75 89.89,17.75 90.96,18.81 93.27,18.81 93.73,18.33 v93.73,15.74
  Route2 1.016: v6.3,68.42 6.29,68.42 6.29,68.47 | v6.27,51.35 6.1,51.35 | v6.07,34.2 6.07,34.18 6.29,34.18 v6.29,17.06 5.99,17.06 5.99,17.09
  Route2 1.27: v88.59,17.19 89,17.19 89.38,17.39 89.56,17.75
  Route2 1.676: 89.38,17.39 87.01,17.39 87.08,15.92 83.08,11.92 79.68,11.92 78.42,10.66 78.42,3.48 76.71,1.77 7.58,1.77 6.29,3.06 v6.29,17.06 6.29,68.47 6.29,68.53
  other vias: 106.38,25.9 107.72,25.62 108.84,24.96 106.73,24.17 102.06,25.7 102.44,22.37 103.78,25.47 107.57,22.42 100.97,24.65 102.18,23.92 108.92,23.31
  pour Top (no thermals): 102.01,26.56 112.4,26.71 112.52,26.51 112.5,20.23 112.24,19.98 109.5,19.98 107.82,21.66 101.02,21.66 100.2,22.47 100.41,25.42
  pour Top (no thermals): 90.32,20.21 90.32,17.82 89.71,16.7 86.36,16.68 86.41,17.57 86.41,22.62 87.45,22.62 87.43,20.95 87.5,20.36 90.2,20.34
  pour Route2 (isolate 0.254, no thermals): 100.43,24.98 102.34,26.43 108.89,26.43 110.03,25.9 109.98,22.22 109.27,21.5 100.63,21.5 99.97,22.16
ADDR0  (via drill 0.25)
  Top 0.127: U2.C16 42.34,39.89 46.84,39.89 46.99,39.74 47.42,39.74 47.57,39.89 49.02,39.89 50.29,38.62 55.22,38.62 55.35,38.75 61.24,38.75 v61.8,38.6 | v80.29,40.81 79.48,41.61 U9.10
  Route2 0.127: v61.8,38.6 62.08,38.5 80.19,38.5 80.29,38.6 v80.29,40.81
ADDR1  (via drill 0.25)
  Top 0.127: U2.T15 41.57,29.47 41.96,29.87 v51.51,29.87 | v51.49,39.11 v62.71,39.11 | v79.02,39.23 79.02,45.02 78.92,45.13 78.92,45.58 U9.11
  Route2 0.127: v51.51,29.87 51.51,39.08 v51.49,39.11 | v62.71,39.11 78.89,39.11 v79.02,39.23
ADDR2  (via drill 0.25)
  Top 0.127: U2.R16 42.32,30.24 50.91,30.25 v51.03,30.37 | v50.8,39.18 50.8,39.31 51.11,39.62 62.31,39.62 v62.38,39.69 | v78.51,39.77 78.51,45.62 U9.12
  Route2 0.127: v51.03,30.37 51.03,38.65 v50.8,39.18 | v62.38,39.69 78.44,39.69 v78.51,39.77
ADDR3  (via drill 0.25)
  Top 0.127: U2.R15 41.52,30.29 41.91,30.67 50.44,30.67 v50.47,30.7 | v50.29,39.69 50.29,39.82 50.6,40.12 61.72,40.12 v61.82,40.22 | v77.98,40.35 U9.13
  Route2 0.127: v50.47,30.7 50.47,38.37 50.22,38.62 50.22,39.62 v50.29,39.69 | v61.82,40.22 77.85,40.22 v77.98,40.35
ADDR4  (via drill 0.25)
  Top 0.127: U2.P16 49.78,31.07 v49.94,31.23 | v49.81,40.45 49.96,40.6 61.21,40.6 v61.32,40.71 | v77.47,40.83 77.47,45.63 U9.14
  Route2 0.127: v49.94,31.23 49.94,38.34 49.73,38.55 49.73,40.38 v49.81,40.45 | v61.32,40.71 77.34,40.71 v77.47,40.83
ADDR5  (via drill 0.25)
  Top 0.127: U2.P15 41.91,31.47 49.02,31.47 49.12,31.56 v49.33,31.56 | v48.97,40.81 48.97,40.88 49.07,40.99 60.66,40.99 v60.88,41.22 | v77.01,41.39 77.01,45.61 U9.15
  Route2 0.127: v49.33,31.56 49.33,40.45 v48.97,40.81 | v60.88,41.22 76.83,41.22 v77.01,41.39
ADDR6  (via drill 0.25)
  Top 0.127: U9.50 53.72,37.27 v53.71,37.28 | v53.72,31.88 53.28,31.88 53.09,32.07 42.82,32.07 42.63,31.88 U2.N16
  Route2 0.127: v53.71,37.28 53.71,31.89 v53.72,31.88
ADDR7  (via drill 0.25)
  Top 0.127: U9.53 55.08,35.77 v55.08,35.75 | v54.99,32.69 42.32,32.69 U2.M16
  Route2 0.127: v55.08,35.75 55.09,35.75 55.09,32.76 55.03,32.69 v54.99,32.69
ADDR8  (via drill 0.25)
  Top 0.127: U9.54 54.37,35.27 v54.37,35.25 | v41.12,33.07 41.13,33.06 U2.M15
  Route2 0.127: v54.37,35.25 54.36,35.25 v54.33,33.21
  Route3 0.127: v54.33,33.21 54.33,32.82 54.2,32.63 41.49,32.63 v41.12,33.07
ADDR9  (via drill 0.25)
  Top 0.127: U9.55 v53.18,34.77 v53.17,34.76 | v53.14,33.25 52.83,33.47 51.89,34.08 42.98,34.08 42.35,33.45 42.34,33.45 U2.L16
  Route2 0.127: v53.17,34.76 53.17,33.49 v53.14,33.25
ADDR10  (via drill 0.25)
  Top 0.127: U9.56 56.44,34.27 v56.43,34.28 | v56.45,28.27 40.84,28.27 40.69,28.43 40.69,29.44 U2.T14
  Route2 0.127: v56.43,34.28 56.43,28.3 v56.45,28.27
ADDR11  (via drill 0.25)
  Top 0.127: U9.57 v57.11,33.77 v57.1,33.77 | v57.15,28.79 41.19,28.79 41.12,28.86 41.12,29.87 U2.R14
  Route2 0.127: v57.1,33.77 57.1,30.27 57.11,30.25 57.11,28.83 v57.15,28.79
ADDR12  (via drill 0.25)
  Top 0.127: 40.66,31.07 U2.P14 v41.11,30.69 | v43.79,27.73 43.66,27.8 v41.33,27.8 | v73.51,21.5 73.51,24.37 U9.87
  Route3 0.127: v43.79,27.73 43.79,26.05 46.46,23.38 55.91,23.38 56.92,22.37 66.42,22.37 67.18,21.61 73.41,21.61 v73.51,21.5 | v41.11,30.69 41.12,27.85 v41.33,27.8
ADDR13  (via drill 0.25)
  Top 0.127: U2.L14 40.72,33.49 v40.34,33.86 | v73.99,22.24 U9.88
  Route2 0.127: v40.34,33.86 40.34,33.92 40.56,34.15 45.19,34.15 45.24,34.1 45.24,28.49 v44.55,27.8
  Route3 0.127: v44.55,27.8 44.55,26 46.63,23.92 56.13,23.92 57.25,22.8 66.75,22.8 67.33,22.22 73.97,22.22 v73.99,22.24
ADDR14  (via drill 0.25)
  Top 0.127: U2.D14 40.7,39.07 v40.34,39.46
  Top 0.152: v74.5,23.49 74.5,24.38 U9.89
  Route2 0.127: v74.47,37.99 74.47,24.4
  Route2 0.152: 74.47,24.4 74.47,23.51 v74.5,23.49
  Route3 0.127: v40.34,39.46 41.12,40.27 45.85,40.27 46.38,39.74 48.01,39.74 48.44,40.17 49,40.17 49.73,39.44 49.73,39.41 50.52,38.62 57.99,38.62 58.19,38.83 61.06,38.83 61.34,39.11 62,39.11 62.46,38.65 74.07,38.65 v74.47,37.99
ADDR15  (via drill 0.25, 0.38)
  Top 0.127: U2.C14 40.75,39.87 41.12,40.27 47.12,40.27 v47.19,40.2
  Top 0.152: v74.98,25.59 U9.90
  Route2 0.127: v47.19,40.2 47.27,40.12 47.27,39.03 47.24,39.01 47.24,28.39 47.17,28.31 47.17,26.56 v47.14,26.53
  Route2 0.152: v75.01,28.11 75.01,25.62 v74.98,25.59
  Route3 0.127: v47.14,26.53 47.37,26.53 47.5,26.41 57.89,26.41 59.72,28.23 74.88,28.23 v75.01,28.11
AUDIO_LEFT
  Top 0.406: R38.1 122.95,12.64 C79.1 | 124.46,11.19 125.72,12.46 J2.R
  Top 0.813: C79.1 124.6,12.68 124.64,12.72 126.37,12.72 J2.R
  pour Top (no thermals): 124.28,14.7 128.75,14.7 129.03,14.42 129.03,10.89 128.63,10.48 124.38,10.48 123.88,10.99 123.88,14.27
AUDIO_RIGHT
  Top 0.406: R37.1 129.55,4.89 C78.1
  Top 0.813: C78.1 J2.L
  pour Top (no thermals): 131.78,7.26 136.25,7.26 136.53,6.98 136.53,3.45 136.12,3.04 131.88,3.04 131.37,3.55 131.37,6.82
CBSEL  (via drill 0.25)
  Top 0.127: U2.P13 40.32,30.66 40.32,28.13 40.34,27.93 v40.44,27.83 | v75.46,20.82 75.48,20.84 U9.91
  Route3 0.127: v40.44,27.83 41.35,26.81 41.35,25.42 45.39,21.38 54.81,21.38 55.91,20.29 64.95,20.29 65.81,19.83 69.04,19.83 69.98,20.41 75.31,20.41 75.46,20.57 v75.46,20.82
CDONE  (via drill 0.25)
  Top 0.127: U2.M10 37.51,32.67 v37.12,32.27 | v65.02,18.28 75.62,18.28 v75.67,18.23 | v75.97,22.47 75.97,22.95 75.92,23.03 75.92,23.71 76,23.87 U9.92
  Route2 0.127: v37.12,32.27 37.06,32.22 37.06,30.93 37.44,30.55 37.44,28.92 38.28,28.08 38.28,27.27 39.34,26.2 41.88,26.2 43.03,25.06 47.47,25.06 48.46,24.07 55.8,24.07 57.05,22.82 64.49,22.82 64.8,22.52 64.8,18.51 v65.02,18.28 | v75.67,18.23 75.67,19.73 76.02,20.08 76.02,22.42 v75.97,22.47
CRESET_B  (via drill 0.25)
  Top 0.127: U2.N11 v37.92,32.27 | v37.92,32.27 | v65.86,18.91 76.28,18.91 v76.48,18.71 | v76.48,23.31 U9.93
  Route2 0.127: v37.92,32.27 37.54,31.89 37.54,31.28 37.85,30.98 37.85,29.12 38.63,28.34 38.63,27.55 39.6,26.58 42.29,26.58 43.31,25.57 47.78,25.57 48.51,24.83 55.88,24.83 57.33,23.38 65.15,23.38 65.58,22.95 65.58,19.19 v65.86,18.91 | v76.48,18.71 v76.48,23.31
DATA0  (via drill 0.25)
  Top 0.127: U2.D16 42.32,39.09 42.72,39.49 46.66,39.49 46.81,39.34 48.69,39.34 v48.82,39.46 | v72.49,25.95 72.49,24.41 U9.85
  Route2 0.127: v48.82,39.46 48.82,26 v48.87,25.87
  Route3 0.127: v48.87,25.87 49.02,25.85 63.27,25.85 63.45,25.67 64.06,25.67 64.24,25.85 71.07,25.85 71.22,26 72.42,26 v72.49,25.95
DATA1  (via drill 0.25)
  Top 0.127: U2.D15 41.54,39.07 41.94,38.67 42.75,38.67 43.08,39.01 46.66,39.01 v46.79,38.88 | v73.08,25.54 73.08,25.44 73,25.36 73,24.41 U9.86
  Route2 0.127: v46.79,38.88 46.79,27.12 v46.35,26.69
  Route3 0.127: v46.35,26.69 46.35,26.28 47.19,25.29 59.59,25.29 60.25,24.78 72.31,24.78 v73.08,25.54
DATA2  (via drill 0.25)
  Top 0.127: U2.B16 47.62,40.68 v47.68,40.63 | v82.68,28.57 82.78,28.52 84.18,28.52 85.22,28.77 U9.114
  Route2 0.127: v47.68,40.63 47.7,40.66 v47.7,27.47
  Route3 0.127: v47.7,27.47 48.41,26.76 57.66,26.76 59.51,28.62 82.53,28.62 v82.68,28.57
DATA3  (via drill 0.25)
  Top 0.127: U2.B15 41.94,41.08 48.21,41.08 v48.31,41.01 | v83.44,29.02 83.68,29.27 U9.115
  Route2 0.127: v48.31,41.01 48.28,40.99 v48.28,27.83
  Route3 0.127: v48.28,27.83 49,27.12 57.4,27.12 59.31,29.02 v83.44,29.02
DATA4  (via drill 0.25)
  Top 0.127: U2.A16 v55.78,41.47 | U9.58 55.78,33.27 v55.78,33.28
  Route2 0.127: v55.78,41.47 v55.79,41.47 v55.78,33.28
DATA5  (via drill 0.25)
  Top 0.127: U9.59 57.78,32.77 v57.72,32.71 | v57.77,42.2 41.71,42.2 41.52,42.02 U2.A15
  Route2 0.127: v57.72,32.71 57.72,42.16 v57.77,42.2
DATA6  (via drill 0.25)
  Top 0.127: U9.60 58.39,32.27 v58.36,32.24 | v58.37,38.26 42.34,38.26 U2.E16
  Route2 0.127: v58.36,32.24 58.36,38.24 v58.37,38.26
DATA7  (via drill 0.25)
  Top 0.127: U9.63 59.02,30.77 v59,30.75 | v59,37.76 42.85,37.76 42.75,37.88 41.96,37.88 U2.F15
  Route2 0.127: v59,30.75 v59,37.76
DATA8  (via drill 0.25)
  Top 0.127: U9.64 v59.72,30.27 | v59.67,36.82 53.21,36.82 52.63,37.46 42.34,37.46 U2.F16
  Route2 0.127: v59.72,30.27 59.72,36.82 v59.67,36.82
DATA9  (via drill 0.25)
  Top 0.127: U9.65 60.37,29.77 v60.35,29.79 | v60.38,36.26 55.93,36.26 55.73,36.41 52.96,36.41 52.32,37.08 41.9,37.08 U2.G15
  Route2 0.127: v60.35,29.79 60.35,36.19 v60.38,36.26
DATA10  (via drill 0.25)
  Top 0.127: U9.66 52.59,29.27 v52.58,29.25 | v52.58,36.11 52.58,36.13 52.05,36.67 U2.G16
  Route2 0.127: v52.58,29.25 v52.58,36.11
DATA11  (via drill 0.25)
  Top 0.127: U9.67 57.94,28.77 56.84,27.68 52.07,27.68 v52.05,27.65 | v52.05,35.47 41.9,35.47 U2.J15
  Route2 0.127: v52.05,27.65 v52.05,35.47
DATA12  (via drill 0.25)
  Top 0.127: U2.J16 51.56,35.07 52.32,34.31 54.97,34.31 55.25,34.03 55.25,33.14 55.6,32.78 v55.65,32.53 | v65.76,31.13 65.76,28.41 65.61,28.26 U9.68
  Route3 0.127: v55.65,32.53 55.68,32.25 56.13,31.72 63.5,31.72 63.55,31.77 64.16,31.77 64.21,31.72 65.18,31.72 v65.76,31.13
DATA13  (via drill 0.25)
  Top 0.127: U2.K15 v41.91,34.66 | v41.91,34.66 | v68.48,20.97 68.48,24.32 U9.77
  Route2 0.127: v44.65,33.27 44.65,33.24 44.68,28.77 44.25,28.34 43.23,28.34 43.16,28.26 v43.16,27.14
  Route3 0.127: v43.16,27.14 43.16,25.98 46.28,22.85 55.63,22.85 56.79,21.81 66.06,21.81 67.11,21.23 67.87,20.97 v68.48,20.97
  Bottom 0.127: v41.91,34.66 42.34,35.12 44.45,35.12 44.7,34.87 v44.65,33.27
DATA14  (via drill 0.25)
  Top 0.127: U2.K16 42.32,34.29 42.7,34.66 45.7,34.66 v45.74,34.61 | v69.01,22.95 69.01,24.36 U9.78
  Route2 0.127: v45.74,34.61 45.74,28.16 v45.34,27.75
  Route3 0.127: v45.34,27.75 45.34,27.68 45.11,27.45 45.11,26.1 46.81,24.4 56.52,24.4 57.56,23.36 66.95,23.36 67.49,22.82 68.89,22.82 v69.01,22.95
DATA15  (via drill 0.25)
  Top 0.127: v57.78,29.79 57.76,29.81 52.3,29.81 51.79,29.3 42.72,29.3 42.57,29.33 42.47,29.43 U2.T16 | v69.49,23.49 69.49,24.38 U9.79
  Route2 0.127: v57.78,29.79 57.78,25.01 v58.04,24.76
  Route3 0.127: v58.04,24.76 59.64,24.76 60.07,24.32 69.39,24.32 69.49,24.22 v69.49,23.49
ETH_RMII_REF_CLK  (via drill 0.38)
  Top 0.203: U9.35 66.98,46.38 v67.33,46.75 | v67.74,63.54 70.54,63.54 70.69,63.39 70.69,63.45 C22.1
  Route2 0.203: v67.33,46.75 67.31,46.85 67.44,46.98 67.44,54.68 v67.46,54.7
  Route3 0.203: v67.46,54.7 67.46,55.13 arc-90 67.66,55.33 67.8,55.33 arc90 68,55.53 68,55.55 arc90 67.8,55.75 67.12,55.75 arc-90 66.92,55.94 66.92,55.97 arc-90 67.12,56.16 67.8,56.16 arc90 68,56.36 68,56.38 arc90 67.8,56.58 67.12,56.58 arc-90 66.92,56.78 66.92,56.8 arc-90 67.12,57 67.8,57 arc90 68,57.19 68,57.22 arc90 67.8,57.41 67.12,57.41 arc-90 66.92,57.61 66.92,57.63 arc-90 67.12,57.83 67.8,57.83 arc90 68,58.03 68,58.05 arc90 67.8,58.25 67.12,58.25 arc-90 66.92,58.44 66.92,58.47 arc-90 67.12,58.66 67.8,58.66 arc90 68,58.86 68,58.88 arc90 67.8,59.08 67.12,59.08 arc-90 66.92,59.28 66.92,59.3 arc-90 67.12,59.5 67.8,59.5 arc90 68,59.69 68,59.72 arc90 67.8,59.91 67.12,59.91 arc-90 66.92,60.11 66.92,60.13 arc-90 67.12,60.33 67.8,60.33 arc90 68,60.53 68,60.55 arc90 67.8,60.75 67.66,60.75 arc-90 67.46,60.94 67.46,63.26 v67.74,63.54
ETH_RX+  (via drill 0.38)
  Top 0.203: U1.23 75.35,57.75 84.86,57.75 85.78,58.66 85.93,58.72 86.87,58.72 | 86.87,58.72 96.93,58.72 104.7,68.04 108.28,68.04 | 108.28,68.04 122.05,68.04 124,66.41 124,61.33 J1.4 | R26.2 v86.72,60.06 | v86.72,58.13 86.72,58.56 86.87,58.72 | Z2.3 108.28,66.79 108.28,68.04
  Route2 0.203: v86.72,60.06 v86.72,58.13
ETH_RX-  (via drill 0.38)
  Top 0.203: U1.22 86.11,57.29 86.33,57.52 88.11,57.52 | 88.11,57.52 96.93,57.52 103.58,65.67 108.36,65.67 | R25.2 88.05,60.07 v88.06,60.06 | v88.09,58.13 88.09,57.55 88.11,57.52 | 108.36,65.67 113.41,65.67 113.87,66.13 116.28,66.13 arc-90 116.48,65.94 arc90 116.68,65.74 117.17,65.74 arc90 117.36,65.94 117.36,66.33 arc-90 117.56,66.53 118.05,66.53 arc-90 118.25,66.33 118.25,65.94 arc90 118.44,65.74 118.94,65.74 arc90 119.13,65.94 arc-90 119.33,66.13 121.11,66.13 121.18,66.06 121.18,58.56 J1.6 | Z2.2 108.33,65.65 108.36,65.67
  Route2 0.203: v88.06,60.06 88.06,58.16 v88.09,58.13
ETH_TX+  (via drill 0.38)
  Top 0.203: U1.21 75.31,56.78 84.78,56.78 85.19,56.38 89.43,56.38 | 110.49,63.39 119.71,63.39 J1.1 | 110.49,63.39 107.49,63.39 arc90 107.29,63.19 arc-90 107.09,62.99 106.57,62.99 arc-90 106.37,63.19 arc90 106.17,63.39 105.33,63.39 98.32,56.38 89.43,56.38 | R23.2 89.37,60.1 v89.41,60.06 | v89.43,56.94 89.43,56.38 | Z1.3 110.49,62.02 110.49,63.39
  Route2 0.203: v89.41,60.06 89.41,56.96 v89.43,56.94
ETH_TX-  (via drill 0.38)
  Top 0.203: U1.20 83.71,56.29 84.51,55.49 90.55,55.49 v90.73,55.67 99.77,55.67 104.95,60.85 110.47,60.85 | J1.3 119.84,60.85 110.47,60.85 | R24.2 90.7,60.11 v90.73,60.09 | Z1.2 110.47,59.81 110.47,60.85
  Route2 0.203: v90.73,60.09 v90.73,55.67
F_LRCLK  (via drill 0.25)
  Top 0.127: U2.G14 40.7,36.67 v40.34,36.29 | v66.52,20.89 66.52,24.35 U9.73
  Route3 0.127: v40.34,36.29 39.67,35.65 39.67,31.99 40.21,31.46 42.42,31.46 42.57,31.31 42.57,25.77 45.95,22.39 55.45,22.39 56.57,21.28 65.79,21.28 v66.52,20.89
F_MCLK  (via drill 0.25)
  Top 0.127: U2.H16 42.56,36.11 v43.38,36.11 | v78,25.72 77.98,25.7 U9.96
  Route2 0.127: v77.93,35.8 78,35.73 v78,25.72
  Route3 0.127: v43.38,36.11 43.41,36.13 51.54,36.13 51.97,36.57 58.39,36.57 59.16,35.8 v77.93,35.8
F_SCLK  (via drill 0.25)
  Top 0.127: U2.H11 v38.71,35.49 | v67.21,20.67 67.21,21.05 66.95,21.3 66.95,24.36 U9.74
  Route3 0.127: v38.71,35.49 39.04,35.47 39.27,35.35 39.27,31.82 39.95,31.16 41.73,31.16 41.94,30.83 41.94,25.59 45.62,21.91 55.04,21.91 56.16,20.79 65.2,20.79 66.17,20.31 66.83,20.31 v67.21,20.67
F_SDIN  (via drill 0.25)
  Top 0.127: U2.E14 v41.12,37.88 | v68,23.36 68,24.38 U9.76
  Route2 0.127: v41.12,37.88 46.1,37.86 46.25,37.71 46.25,27.63 v45.77,27.14
  Route3 0.127: v45.77,27.14 45.77,26.08 46.99,24.86 56.87,24.86 57.61,24.12 57.61,24.09 57.81,23.89 67.87,23.89 68,23.77 v68,23.36
FLASH1_CS  (via drill 0.38)
  Top 0.152: v91.29,30.22 91.29,30.27 92.08,31.05 117.53,31.05 118.06,31.59 118.06,33.39 117.86,33.59 116.18,33.59 116.15,33.57 116.28,33.57 U10.1 | v78.84,26.51 78.84,25.31 78.97,25.19 78.97,24.41 U9.98
  Top 0.203: U10.1 116.27,33.52
  Route2 0.152: v91.29,30.22 91.24,30.27 78.99,30.27 78.99,26.66 v78.84,26.51
FLASH2_CS  (via drill 0.38)
  Top 0.152: v90.96,29.33 93.14,29.33 93.78,28.69 96.93,28.69 97.66,29.43 108.97,29.43 v109.02,29.48 | v108.99,32.63 108.99,33.34 108.84,33.49 108.01,33.49 U11.1 | v79.48,25.51 U9.99
  Route2 0.152: v79.48,25.51 79.48,29.56 79.65,29.73 90.55,29.73 v90.96,29.33 | v109.02,29.48 109.02,32.6 v108.99,32.63
FPGA_40MHZ_REF  (via drill 0.25)
  Top 0.127: 37.12,29.86 37.12,28.82
  Top 0.152: U2.R9 36.72,30.25 37.12,29.86 | 37.12,28.82 37.95,28.01 v37.95,24.58 | v68.66,10.15 70.18,10.15 70.41,10.38 70.41,13.15 70.05,13.5 70.05,15.13 70.18,15.26 70.58,15.26 C113.1
  Route2 0.152: v37.95,24.58 35.89,24.58 35.59,24.27 35.59,5.25 36.27,4.56 68.05,4.56 68.3,4.82 68.3,7.94 v68.63,8.27
  Bottom 0.152: v68.63,8.27 68.63,10.12 v68.66,10.15
FPGA_CFG_CS
  Top 0.127: U2.R12 38.72,29.86 38.72,29.07 38.84,28.95 39.04,28.74 39.04,28.03 40.13,26.94 41.86,26.94 42.09,26.71 42.09,26.23 42.8,25.36 56.57,25.36 58.24,23.84 58.27,23.84 61.92,20.18 78.44,20.18 78.49,20.23 U9.97
FPGA_SPI3_CS
  Top 0.127: U2.T13 39.93,27.6 40.21,27.32 42.34,27.32 42.52,27.14 42.52,26.53 43.13,25.92 47.45,25.92 47.93,26.41 58.57,26.41 60.35,24.63 64.95,24.63 65.99,25.67 67.33,25.67 67.48,25.52 U9.75
FPGA_VCC_1V2  (via drill 0.25)
  Top 0.127: v30.73,33.86 v30.73,33.87 | U2.K6 | 34.32,37.45 U2.F6 | 37.51,37.47 U2.F10 | 37.5,34.27 U2.K10
  Top 0.203: U2.L2 v30.73,33.86 | v33.92,33.87 U2.K6 | v34.71,37.09 34.32,37.45 | v37.12,37.08 37.17,37.13 37.51,37.47 | v37.12,34.67 37.5,34.27 | v40.69,42.16 40.72,42.12 U2.A14 | U2.K10 v37.12,33.87
  Top 0.406: v37.69,23.84 40.23,23.84 41.5,22.57 44.68,22.57 45.09,22.16 45.09,19.88 R50.2
  Route2 0.127: v30.73,33.87 31.22,33.39 | v33.92,33.87 34.42,34.37 | 34.62,37.08 v34.71,37.09 | 37.11,37.15 37.12,37.12 v37.12,37.08 37.11,37.06 37.12,37.05
  Route2 0.203: 31.22,33.39 31.88,33.39 32.77,34.28 33.53,34.28 v33.92,33.87 | 34.42,34.37 34.42,36.87 34.62,37.08 | v34.71,37.09 34.92,37.3 36.96,37.3 37.11,37.15 | 37.12,37.05 v37.12,34.67 | 37.17,37.13 37.42,37.38 | 37.42,37.38 39.83,37.38 40.11,37.66 40.11,38.83 39.78,39.16 39.78,41.49 40.44,42.16 v40.69,42.16 | 37.12,37.12 37.38,37.38 37.42,37.38 | v37.12,33.87 36.83,32.81 36.6,32.43 36.32,30.73 36.93,30.29 36.93,28.21 v37.29,27.85
  Bottom 0.406: v37.29,27.85 37.29,24.25 v37.69,23.84
  pour Top (no thermals): 45.06,20.16 45.31,19.9 45.31,18.74 45.09,18.51 45.09,16.04 44.45,15.41 44.45,13.55 44.3,13.4 43.21,13.4 43,13.61 43,18.63 42.72,18.91 42.72,20.06 42.82,20.16
FSMC_CLK  (via drill 0.25, 0.38)
  Top 0.152: U9.117 87.12,30.27 v87.73,30.9 | v36.32,34.67 | v36.32,34.67 U2.K9
  Bottom 0.152: v87.73,30.9 87.1,30.27 60.94,30.27 59.79,31.21 51.54,31.21 50.06,32.68 43.59,32.68 42.65,33.62 40.89,33.62 40.28,33.01 38.12,33.01 37.97,33.16 37.97,34.81 37.59,35.2 36.83,35.2 v36.32,34.67
FSMC_NE1  (via drill 0.25)
  Top 0.127: U2.J14 40.31,34.66 v40.34,34.69 | v84.38,33.31 84.43,33.27 U9.123
  Route3 0.127: v40.34,34.69 40.92,33.8 55.93,33.8 56.59,33.31 v84.38,33.31
FSMC_NE4  (via drill 0.25)
  Top 0.127: U2.K14 41.11,34.69 v41.12,34.67 | v83.08,35.27 U9.127
  Route3 0.127: v41.12,34.67 41.5,34.13 53.64,34.13 53.64,34.31 54.1,34.76 82.58,34.76 v83.08,35.27
FSMC_NL_NADV  (via drill 0.25)
  Top 0.127: U2.B14 v41.12,41.08 | v41.12,41.08 | v79.53,40.73 79.99,40.27 U9.137
  Route3 0.127: v41.12,41.08 41.5,41.47 54.64,41.47 55.09,41.01 59.59,41.01 60.25,41.67 61.62,41.67 62.1,41.19 75.95,41.19 76.78,42.03 79.43,42.03 79.53,41.93 v79.53,40.73
FSMC_NOE  (via drill 0.25)
  Top 0.127: U2.F14 v41.12,37.08 | v82.47,30.77 82.48,30.77 U9.118
  Route2 0.127: v82.42,37.33 82.47,37.28 v82.47,30.77
  Route3 0.127: v41.12,37.08 41.53,36.67 51.21,36.67 51.64,37.1 52.81,37.1 53.09,36.82 57.66,36.82 58.11,37.28 64.69,37.28 64.75,37.33 v82.42,37.33
FSMC_NWE  (via drill 0.25)
  Top 0.127: U2.H14 41.15,35.45 v41.12,35.47 | v81.43,31.28 81.45,31.27 U9.119
  Route2 0.127: v81.43,35.35 v81.43,31.28
  Route3 0.127: v41.12,35.47 51.28,35.47 51.84,34.92 52.35,34.92 53.67,36.24 55.7,36.24 56.62,35.32 v81.43,35.35
GND  (via drill 0.25, 0.38, 0.64)
  Top 0.152: U9.16 | C40.2 69,45.78 68.98,45.76 | U1.GP v73.43,56.96
  Top 0.203: U9.16 v76.48,44.72 | v35.51,36.29 U2.G7 | U2.G8 35.94,36.67 v36.32,36.29 36.34,36.29 U2.G9 | U2.H9 v36.32,35.47 U2.J9 | U2.H8 35.91,35.87 v35.51,35.47 | U2.H7 v35.51,35.47 | U2.J7 35.12,35.09 v35.51,35.47 | U2.J8 35.91,35.07 v35.51,35.47 | U2.K7 v35.51,34.66 | 32.72,41.42 U2.A4 32.96,41.85 v33.03,41.98 | U2.A12 39.12,41.42 v38.73,41.09 | v41.12,38.67 U2.E15 | U2.K2 | U2.K2 v31.52,33.87 | v33.12,29.87 | v33.12,29.87 U2.T4 | v34.72,30.67 U2.R7 | v39.42,29.02 39.12,29.35 U2.T12 | v41.92,33.07 41.76,33.21 U2.L15 | U3.10 64.16,8.04 64.54,8.42 65.28,8.42 | 65.28,8.42 65.38,8.32 65.38,6.91 U3.11 | U3.12 66.7,8.17 66.45,8.42 66.17,8.42 | 66.17,8.42 65.28,8.42 | U3.13 67.97,8.14 67.67,8.45 66.19,8.45 66.17,8.42 | v65.99,8.3 66.14,8.45 66.17,8.42 | U3.7 v61.62,14.37 | U2.N8 35.91,31.87 v35.53,32.26 | U2.E7 v34.72,37.88 | C21.1 78.44,52.9 v78.46,53.18 | C5.1 72.67,50.41 72.82,50.56 74.15,50.56 74.19,50.52
  Top 0.254: U9.38 v65.7,43.27 v65.71,43.27 | U9.51 v65.73,36.77 | U9.61 65.28,31.77 v65.71,31.94 | U9.83 71.48,25.43 v71.45,25.47 | U9.94 76.98,25.09 v77.04,25.36 | U9.107 83.48,25.5 v83.46,25.52 | U9.120 v84.71,31.77 | U9.130 86.56,36.77 v87.05,36.54 | U9.138 84.74,40.77 v84.73,40.76 | v68.96,44.54 68.98,44.44 U9.31 68.98,45.76 68.98,45.89 69,45.91 | C100.2 59.77,26.76 | 59.77,26.76 v59.44,27.09 | 59.77,26.76 59.59,26.76 59.39,26.56 59.39,26.58 59.41,26.61 | C40.2 69,47.9 C95.2 | U7.8 v114.81,11.39 | v115.85,14.21 115.38,14.21 C74.2 115.3,13.73 v115.88,13.73 | C103.2 105.78,32.28 105.78,36.88 106.66,37.36 U11.4 109.28,37.36 v109.31,37.39 | C104.2 114.41,32.03 114.41,37.09 114.69,37.36 U10.4 117.63,37.36 v117.64,37.37 | 122.07,28.18 v122.06,28.17
  Top 0.305: R5.2 57.43,7.51 X5.GND | Q1.2 v45.36,42.96 v45.36,42.97
  Top 0.406: C87.2 v63.3,44.19 | C98.2 v61.21,36.34 | C101.2 61.27,31.26 v61.24,31.23 | C90.2 60.73,25.34 v60.71,25.31 | C88.2 v72.01,20.89 | v77.5,20.92 77.5,21.36 C89.2 | 82.91,20.44 82.91,20.26 v83.13,20.03 | C102.2 82.91,20.44 | 82.91,20.44 82.53,20.06 82.5,20.06 82.47,20.08 82.55,20.08 82.58,20.06 | C85.2 v84.15,21.3 | C94.2 v89.36,32.3 | C91.2 v88.98,37.23 | C96.2 89.28,43.22 v89.31,43.25 | C92.2 89.15,44.03 89.18,44.06 v89.33,44.06 | R35.1 126.44,3.04 v126.47,3.01 | C99.2 v66.9,49.11 | v92.38,17.39 91.85,16.86 U12.GPAD | C86.2 v78.41,46.98 | C17.2 77.22,65.75 | 77.22,65.75 77.22,65.83 v77.19,65.85 | C42.2 68.49,61.6 v68.48,61.61 | C43.2 69.37,59.55 v69.39,59.17 | C39.2 76.47,51.51 v76.48,51.5 | C41.2 78.68,60.68 v78.69,60.67 | R1.2 79.52,59.03 v79.53,59.02 | X1.GND 73.78,65.18 74.24,65.65 77.11,65.65 77.22,65.75 | C2.2 v82.75,64 | Z1.1 v108.79,58.72 | Z2.1 106.3,64.2 v105.64,64.2 | C19.2 v74.14,15.31 74.24,15.21 U5.3 | C18.2 v73.84,9.77 73.84,9.01 U6.3 | C12.2 v70.33,7.81 | C4.2 57.25,11.06 v57.28,11.09 | U17.2 54.71,13.4 54.26,12.95 C3.2 52.77,13.46 v52.7,13.53 | U17.2 | U17.2 54.71,15.25 C221.2 | R49.2 65.37,17.2 | 65.37,17.2 65.37,17.35 v65.18,17.54 | 65.37,17.2 v65.71,17.54 | X3.GND@2 74.19,50.52 74.71,50.52 75.21,51.02 v75.21,51.45 | v78.74,48.3 77.66,48.3 X3.GND@1 | Z3.1 126.45,47.51 126.45,47.88 | 126.45,47.88 v126.45,48.42 | 126.45,47.88 127.03,47.88 127.03,48.45 | U8.3 127.36,30.77 v127.37,30.76 | U8.13 v123.97,28.05 | C23.2 122.07,28.18 | C24.2 v120.76,32.02 v120.76,32.01 | C25.2 47.35,47.04 v47.35,47.77 | Q16.2 41.27,47.94 v41.25,47.92
  Top 0.61: R36.1 v120.01,14.52 | C73.1 111.98,8.8 v110.77,8.8 | C72.2 v105.31,7.26 | C71.2 v105.79,8.88 | v106.07,16.4 106.02,16.45 106.02,16.48 | C76.2 110.67,17.27 v110.67,18.51 | 96.71,21.61 v97.16,22.05 | C109.2 96.71,21.61 | 96.71,21.61 97.18,21.14 | C110.2 88.99,22.95 v88.98,22.96 | 65.29,49.05 65.29,49.13 v65.56,49.39 | C16.2 65.29,49.05 | 65.29,49.05 64.97,49.37 | R3.2 109.97,64.67 v109.93,64.71 | R4.2 109.94,56.34 v109.91,56.3 | v57.25,10.05 C222.2 56.69,10.03 56.69,7.89 56.91,7.67 X5.GND
  Top 0.813: C111.C 84.55,18.41 | 84.55,18.41 84.55,17.36 v84.38,17.19 | 84.55,18.41 83.83,18.41 83.24,17.82 | C111.C 83.34,19.27 83.16,19.09 | C111.C 84.4,19.27 83.19,20.49 | C111.C 84.55,21.15 84.43,21.28 | C107.2 v94.55,10.34 v94.54,10.33 | C107.2 94.74,11.72 94.89,11.57 | 94.89,11.57 95.73,10.73 | 94.89,11.57 95.22,11.57 95.78,12.13 | C107.2 94.88,12.9 94.89,13.15 | 90.12,7.76 C106.C 90.93,8.57 91.11,8.4 | 90.12,7.76 90.09,7.69 v89.61,7.08 | 90.12,7.76 v90.83,7.05 90.88,7.15 | 91.11,8.4 91.97,7.53 | 91.11,8.4 91.85,8.4 92.08,8.63 | C78.2 128.59,3.31 v128.5,3.22 | C79.2 v122.99,15.46
  Top 1.016: CON1.6 137.52,28.57 v137.54,28.59 | CON1.8 132.07,28.47 v131.95,28.59 | CON1.7 137.52,16.52 v137.54,16.55 | CON1.9 132.07,16.57 v132,16.5 | CON1.8 132.07,27.3 v130.84,28.54 | CON1.8 132.07,27.59 v133.07,28.59 | CON1.6 137.52,27.49 v136.47,28.54 | CON1.6 137.52,27.46 v138.61,28.54 | CON1.7 137.52,17.55 v136.42,16.45 | CON1.7 137.52,17.64 v138.66,16.5 | CON1.9 132.07,17.59 v130.94,16.45 | CON1.9 132.07,17.55 v133.12,16.5 | v136.83,12.99 136.29,12.46 J2.G 135.12,12.92 | 135.12,12.92 135.12,12.97 | 135.12,12.97 v136.42,14.27 | 135.12,12.97 135.12,14.39 v135.1,14.42 | 135.12,12.92 135.03,13.02 | 135.03,13.02 v133.83,14.21 | 135.03,13.02 133.45,13.02 v133.38,12.95
  Bottom 0.203: 35.51,32.25 v35.53,32.26 35.51,32.25 C9.2 | 33.12,35.47 33.12,32.66 33.98,31.82 34.88,31.82